# EAGLE design Baseboard Rev2 (EAGLE 9.6.2)

## Sheet 1 of 6
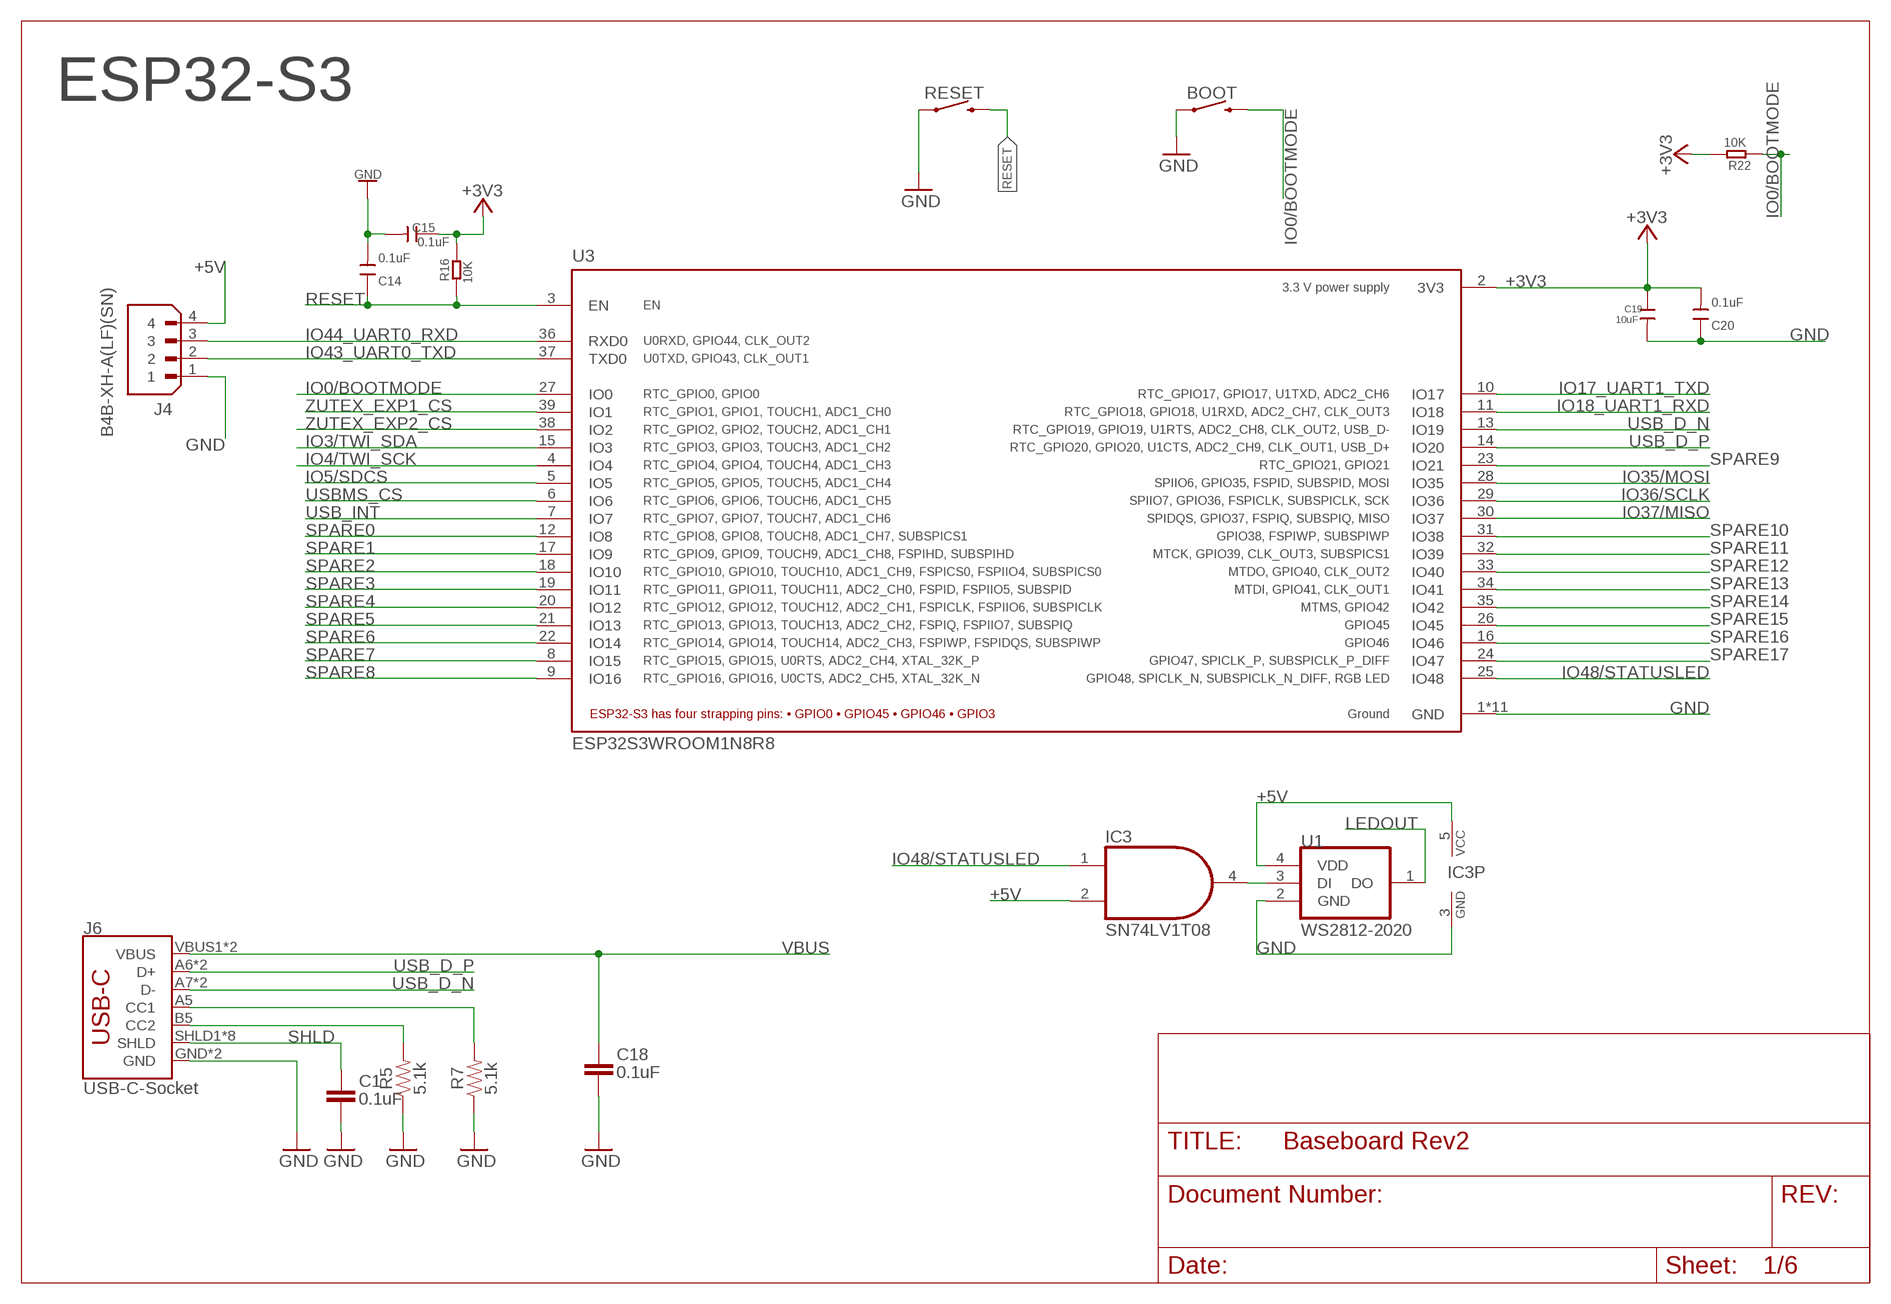
[diagram p0: schematic, sheet 1]

### Parts
BOOT  MOMENTARY-SWITCH-SPST-SMD-6.0X3.5MM  [TACTILE_SWITCH_SMD_6.0X3.5MM]
C1  0.1uF  CAP0603-CAP  [0603-CAP]
C14  0.1uF  DISCRETE_C-0603  [DISCRETE_C0603]
C15  0.1uF  DISCRETE_C-0603  [DISCRETE_C0603]
C18  0.1uF  CAP0603-CAP  [0603-CAP]
C19  10uF  C-1206  [C1206]
C20  0.1uF  DISCRETE_C-0603  [DISCRETE_C0603]
IC3  SN74LV1T08  74AHC1G08DBV  [SOT23-5]
J4  B4B-XH-A(LF)(SN)  [JST_B4B-XH-A(LF)(SN)]
J6  USB-C-Socket  USB_C16PIN  [USB-C-16P]
R5  5.1k  5.1KOHM5.1KOHM-0603-1/10W-1%  [0603@1]
R7  5.1k  5.1KOHM5.1KOHM-0603-1/10W-1%  [0603@1]
R16  10K  R-0603  [R0603]
R22  10K  R-0603  [R0603]
RESET  MOMENTARY-SWITCH-SPST-SMD-6.0X3.5MM  [TACTILE_SWITCH_SMD_6.0X3.5MM]
U1  WS2812-2020  [LED_WS2812-2020]
U3  ESP32S3WROOM1N8R8  [XCVR_ESP32S3WROOM1N8R8]

### Nets
+3V3: C15.1 C19.1 C20.2 R16.2 R22.2 U3.2(3V3) ; also sheet 2,3,4,5
+5V: IC3.2(I1) IC3.5(VCC) J4.4 U1.4(VDD) ; also sheet 2,4,5
CC1: J6.A5(CC1) R7.2
CC2: J6.B5(CC2) R5.2
GND: BOOT.1 C1.2 C14.2 C15.2 C18.2 C19.2 C20.1 IC3.3(GND) J4.1 J6.GND J6.GND2(GND) R5.1 R7.1 RESET.1 U1.2(GND) U3.1(GND) U3.40(GND) U3.41_1(GND) U3.41_2(GND) U3.41_3(GND) U3.41_4(GND) U3.41_5(GND) U3.41_6(GND) U3.41_7(GND) U3.41_8(GND) U3.41_9(GND) ; also sheet 2,3,4,5
IO0/BOOTMODE: BOOT.2 R22.1 U3.27(IO0)
IO3/TWI_SDA: U3.15(IO3) ; also sheet 5
IO4/TWI_SCK: U3.4(IO4) ; also sheet 5
IO5/SDCS: U3.5(IO5) ; also sheet 3
IO17_UART1_TXD: U3.10(IO17) ; also sheet 5
IO18_UART1_RXD: U3.11(IO18) ; also sheet 5
IO35/MOSI: U3.28(IO35) ; also sheet 3,4,5
IO36/SCLK: U3.29(IO36) ; also sheet 3,4,5
IO37/MISO: U3.30(IO37) ; also sheet 3,4,5
IO43_UART0_TXD: J4.2 U3.37(TXD0) ; also sheet 5
IO44_UART0_RXD: J4.3 U3.36(RXD0) ; also sheet 5
IO48/STATUSLED: IC3.1(I0) U3.25(IO48)
LEDOUT: U1.1(DO) ; also sheet 5
N$2: IC3.4(O) U1.3(DI)
RESET: C14.1 R16.1 RESET.2 U3.3(EN) ; also sheet 5
SHLD: C1.1 J6.SHLD1(SHLD) J6.SHLD2(SHLD) J6.SHLD3(SHLD) J6.SHLD4(SHLD) J6.SHLD5(SHLD) J6.SHLD6(SHLD) J6.SHLD7(SHLD) J6.SHLD8(SHLD)
SPARE0: U3.12(IO8) ; also sheet 5
SPARE1: U3.17(IO9) ; also sheet 5
SPARE2: U3.18(IO10) ; also sheet 5
SPARE3: U3.19(IO11) ; also sheet 5
SPARE4: U3.20(IO12) ; also sheet 5
SPARE5: U3.21(IO13) ; also sheet 5
SPARE6: U3.22(IO14) ; also sheet 5
SPARE7: U3.8(IO15) ; also sheet 5
SPARE8: U3.9(IO16) ; also sheet 5
SPARE9: U3.23(IO21) ; also sheet 5
SPARE10: U3.31(IO38) ; also sheet 5
SPARE11: U3.32(IO39) ; also sheet 5
SPARE12: U3.33(IO40) ; also sheet 5
SPARE13: U3.34(IO41) ; also sheet 5
SPARE14: U3.35(IO42) ; also sheet 5
SPARE15: U3.26(IO45) ; also sheet 5
SPARE16: U3.16(IO46) ; also sheet 5
SPARE17: U3.24(IO47) ; also sheet 5
USB_D_N: J6.A7(D-) J6.B7(D-) U3.13(IO19)
USB_D_P: J6.A6(D+) J6.B6(D+) U3.14(IO20)
USB_INT: U3.7(IO7) ; also sheet 4
USBMS_CS: U3.6(IO6) ; also sheet 4
VBUS: C18.1 J6.VBUS1(VBUS) J6.VBUS2(VBUS) ; also sheet 2
ZUTEX_EXP1_CS: U3.39(IO1) ; also sheet 5
ZUTEX_EXP2_CS: U3.38(IO2) ; also sheet 5

### Notes on the sheet
- ESP32-S3

## Sheet 2 of 6
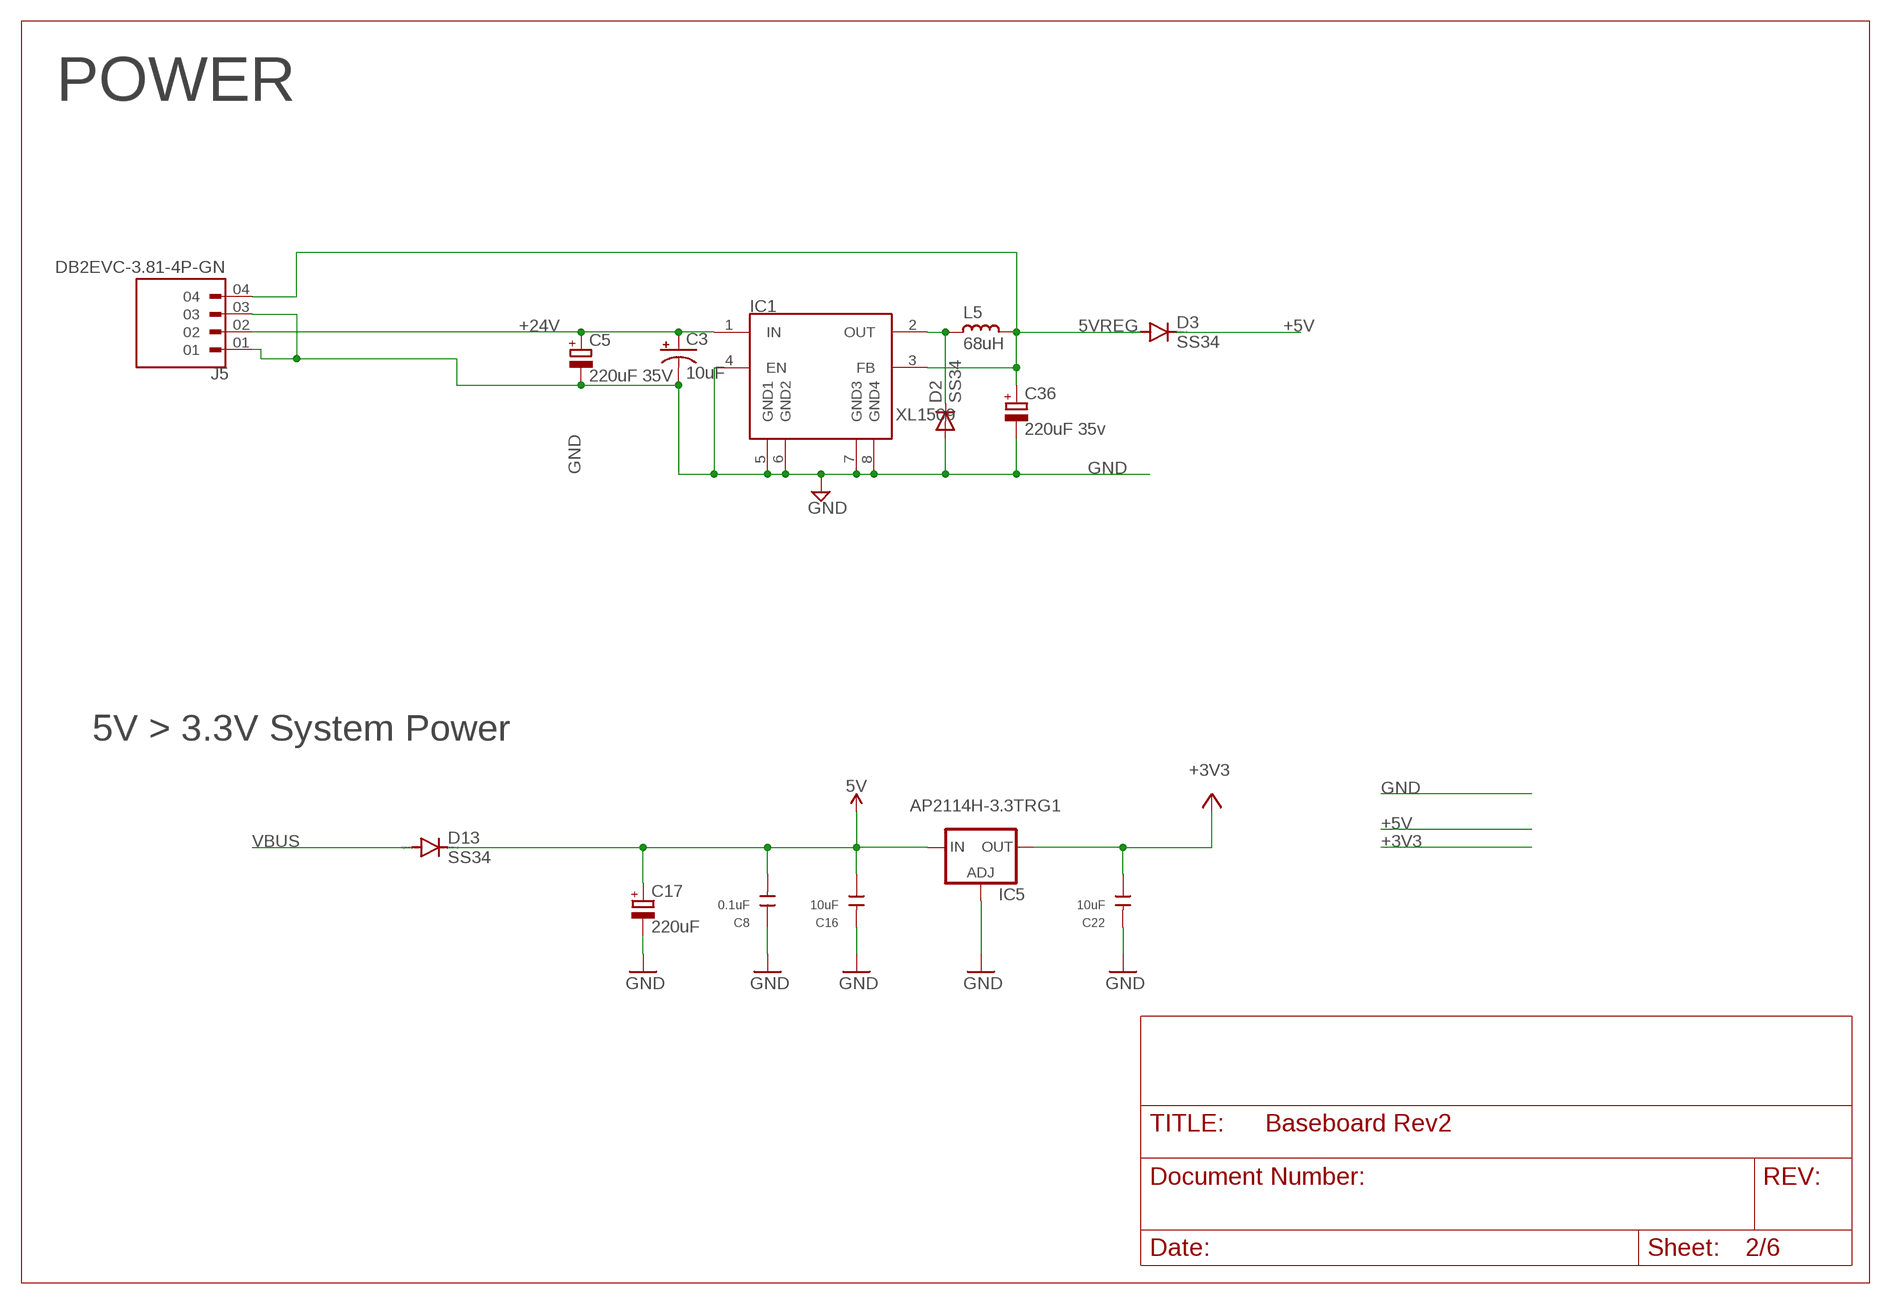
[diagram p1: schematic, sheet 2]

### Parts
C3  10uF  CAP_POL1206  [EIA3216]
C5  220uF 35V  CPOL-EUD  [PANASONIC_D]
C8  0.1uF  DISCRETE_C-0603  [DISCRETE_C0603]
C16  10uF  C-1206  [C1206]
C17  220uF  CPOL-EUD  [PANASONIC_D]
C22  10uF  C-1206  [C1206]
C36  220uF 35v  CPOL-EUD  [PANASONIC_D]
D2  SS34  DIODE-DO-214AC  [DO-214AC]
D3  SS34  DIODE-DO-214AC  [DO-214AC]
D13  SS34  DIODE-DO-214AC  [DO-214AC]
IC1  XL1509  [SO08]
IC5  AP2114H-3.3TRG1  LD117AS33TR  [SOT223]
J5  DB2EVC-3.81-4P-GN  [DB2EVC-3.81-4P-GN]
L5  68uH  L_CD75  [CD75]

### Nets
5VREG: C36.+ D3.A IC1.3(FB) J5.04 L5.1
+3V3: C22.1 IC5.4(OUT) ; also sheet 1,3,4,5
+5V: C8.2 C16.1 C17.+ D3.C D13.C IC5.3(IN) ; supply symbol labelled 5V ; also sheet 1,4,5
+24V: C3.A(+) C5.+ IC1.1(IN) J5.02 ; also sheet 5
GND: C3.C(-) C5.- C8.1 C16.2 C17.- C22.2 C36.- D2.2(A) IC1.4(EN) IC1.5(GND1) IC1.6(GND2) IC1.7(GND3) IC1.8(GND4) IC5.1(ADJ) J5.01 J5.03 ; also sheet 1,3,4,5
N$37: D2.1(C) IC1.2(OUT) L5.2
VBUS: D13.A ; also sheet 1

### Notes on the sheet
- POWER
- 5V > 3.3V System Power

## Sheet 3 of 6
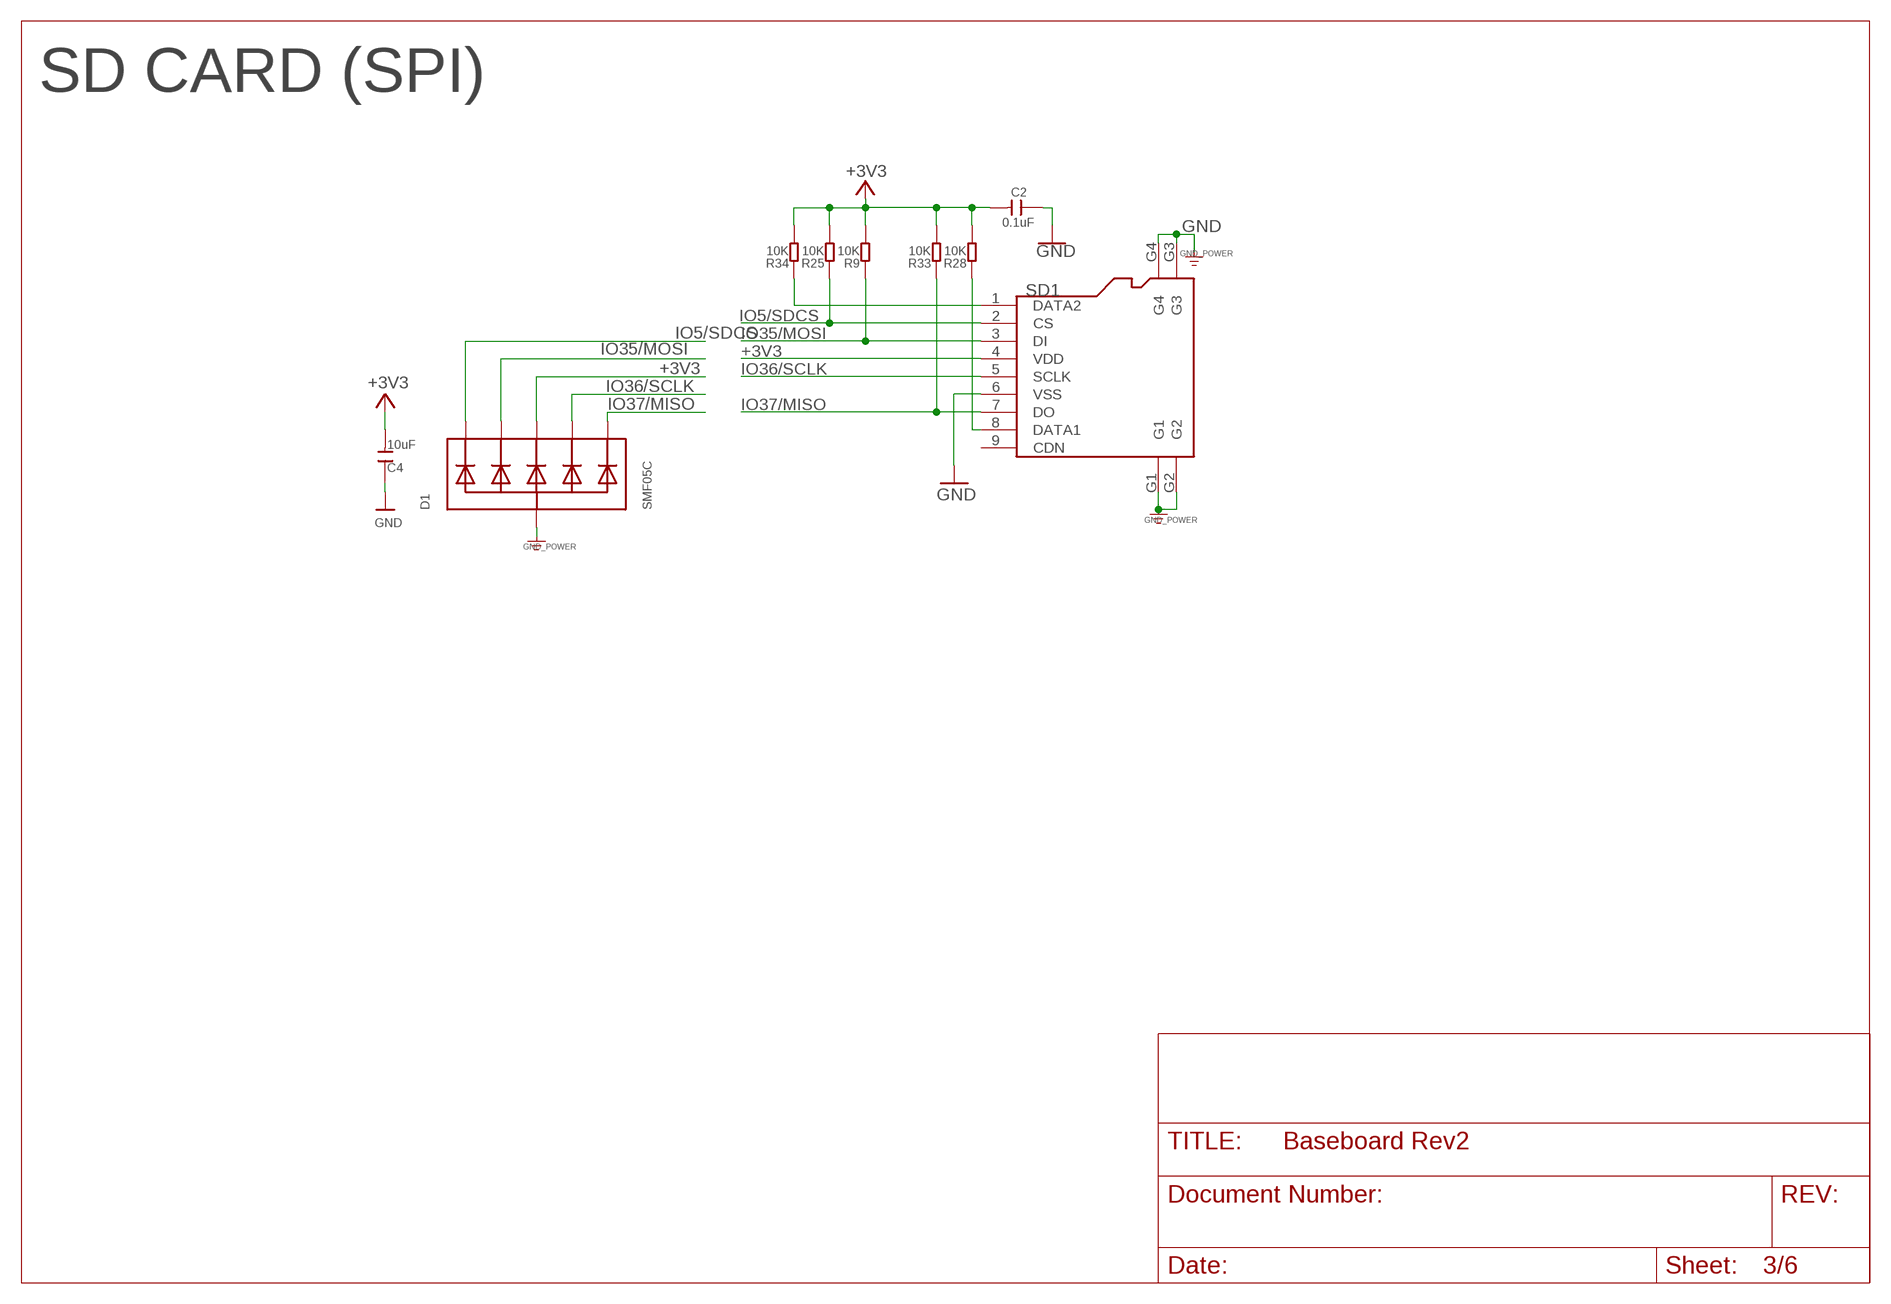
[diagram p2: schematic, sheet 3]

### Parts
C2  0.1uF  DISCRETE_C-0603  [DISCRETE_C0603]
C4  10uF  DISCRETE_C-1206  [DISCRETE_C1206]
D1  SMF05C  TVSARRAY_5LANE  [SOT363]
R9  10K  DISCRETE_R-0603  [DISCRETE_R0603]
R25  10K  DISCRETE_R-0603  [DISCRETE_R0603]
R28  10K  DISCRETE_R-0603  [DISCRETE_R0603]
R33  10K  DISCRETE_R-0603  [DISCRETE_R0603]
R34  10K  DISCRETE_R-0603  [DISCRETE_R0603]
SD1  HOLDER-MICROSD-9P  [9P-SMD-W/-RING]

### Nets
+3V3: C2.2 C4.2 D1.4(C3) R9.2 R25.2 R28.2 R33.2 R34.2 SD1.4(VDD) ; also sheet 1,2,4,5
GND: C2.1 C4.1 D1.2(A) SD1.6(VSS) SD1.G1 SD1.G2 SD1.G3 SD1.G4 ; supply symbol labelled GND_POWER ; also sheet 1,2,4,5
IO5/SDCS: D1.1(C1) R25.1 SD1.2(CS) ; also sheet 1
IO35/MOSI: D1.3(C2) R9.1 SD1.3(DI) ; also sheet 1,4,5
IO36/SCLK: D1.5(C4) SD1.5(SCLK) ; also sheet 1,4,5
IO37/MISO: D1.6(C5) R33.1 SD1.7(DO) ; also sheet 1,4,5
N$47: R34.1 SD1.1(DATA2)
N$48: R28.1 SD1.8(DATA1)
Unconnected: SD1.9(CDN)

### Notes on the sheet
- SD CARD (SPI)

## Sheet 4 of 6
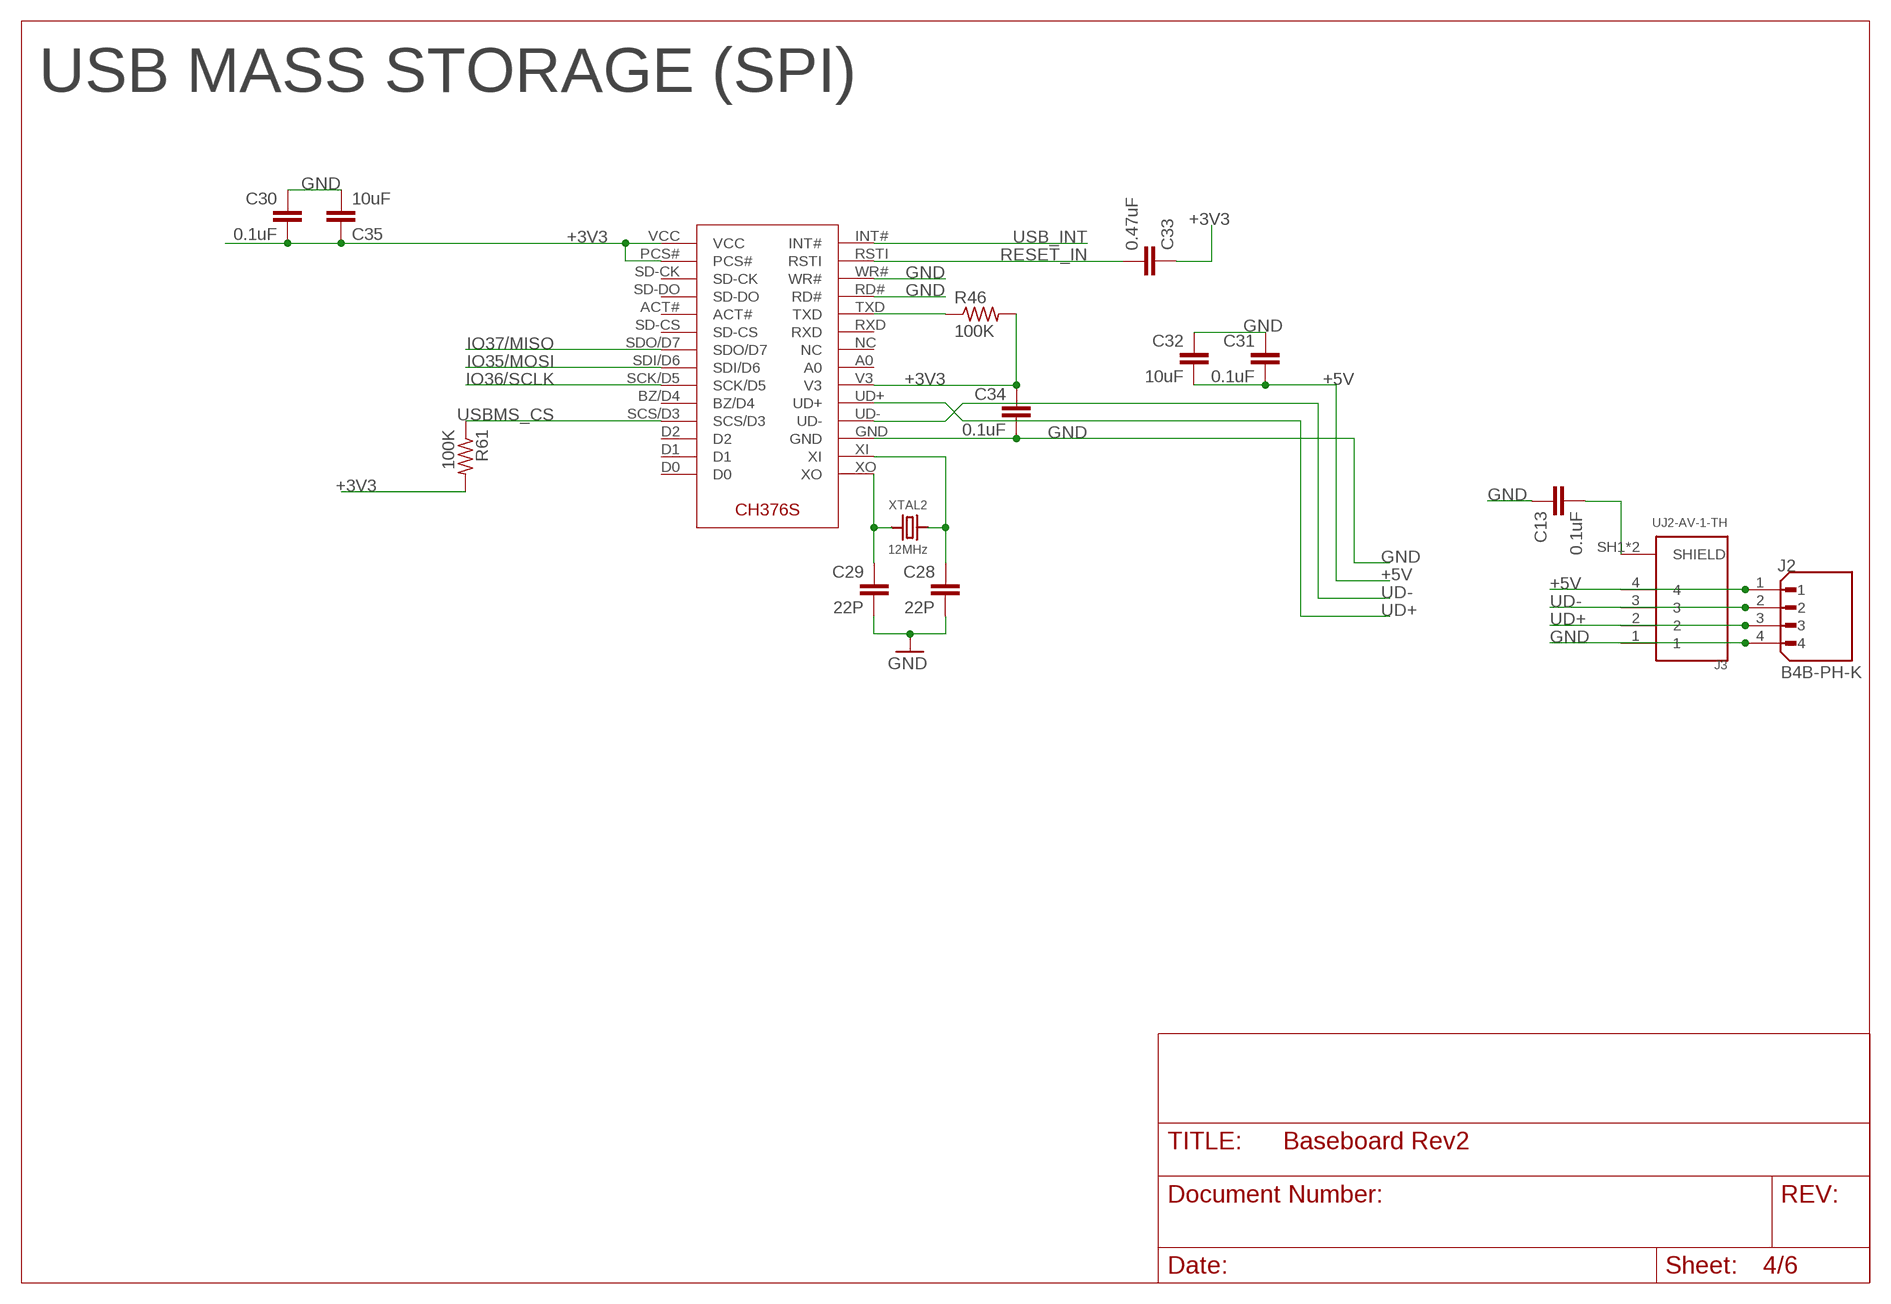
[diagram p3: schematic, sheet 4]

### Parts
C13  0.1uF  C-EUC0603  [C0603]
C28  22P  C-EUC0603  [C0603]
C29  22P  C-EUC0603  [C0603]
C30  0.1uF  C-EUC0603  [C0603]
C31  0.1uF  C-EUC0603  [C0603]
C32  10uF  C-EUC1206  [C1206]
C33  0.47uF  C-EUC0603  [C0603]
C34  0.1uF  C-EUC0603  [C0603]
C35  10uF  C-EUC1206  [C1206]
IC2  CH376  [CH376S-SOIC]
J2  B4B-PH-K  [JST_B4B-PH-K]
J3  UJ2-AV-1-TH  [CUI_UJ2-AV-1-TH]
R46  100K  R-US_R0603  [R0603]
R61  100K  R-US_R0603  [R0603]
XTAL2  12MHz  CRYSTALTHIN  [CRYSTAL_3.2X2.5]

### Nets
+3V3: C30.2 C33.1 C34.1 C35.1 IC2.PCS# IC2.V3 IC2.VCC R46.2 R61.2 ; also sheet 1,2,3,5
+5V: C31.2 C32.2 J2.1 J3.4 ; also sheet 1,2,5
GND: C13.1 C28.2 C29.2 C30.1 C31.1 C32.1 C34.2 C35.2 IC2.GND IC2.RD# IC2.WR# J2.4 J3.1 ; also sheet 1,2,3,5
IO35/MOSI: IC2.SDI/D6 ; also sheet 1,3,5
IO36/SCLK: IC2.SCK/D5 ; also sheet 1,3,5
IO37/MISO: IC2.SDO/D7 ; also sheet 1,3,5
N$19: C13.2 J3.SH1(SHIELD) J3.SH2(SHIELD)
N$31: C28.1 IC2.XI XTAL2.1
N$32: C29.1 IC2.XO XTAL2.2
N$38: IC2.TXD R46.1
RESET_IN: C33.2 IC2.RSTI
UD+: IC2.UD+ J2.3 J3.2
UD-: IC2.UD- J2.2 J3.3
USB_INT: IC2.INT# ; also sheet 1
USBMS_CS: IC2.SCS/D3 R61.1 ; also sheet 1
Unconnected: IC2.A0 IC2.ACT# IC2.BZ/D4 IC2.D0 IC2.D1 IC2.D2 IC2.NC IC2.RXD IC2.SD-CK IC2.SD-CS IC2.SD-DO

### Notes on the sheet
- USB MASS STORAGE (SPI)

## Sheet 5 of 6
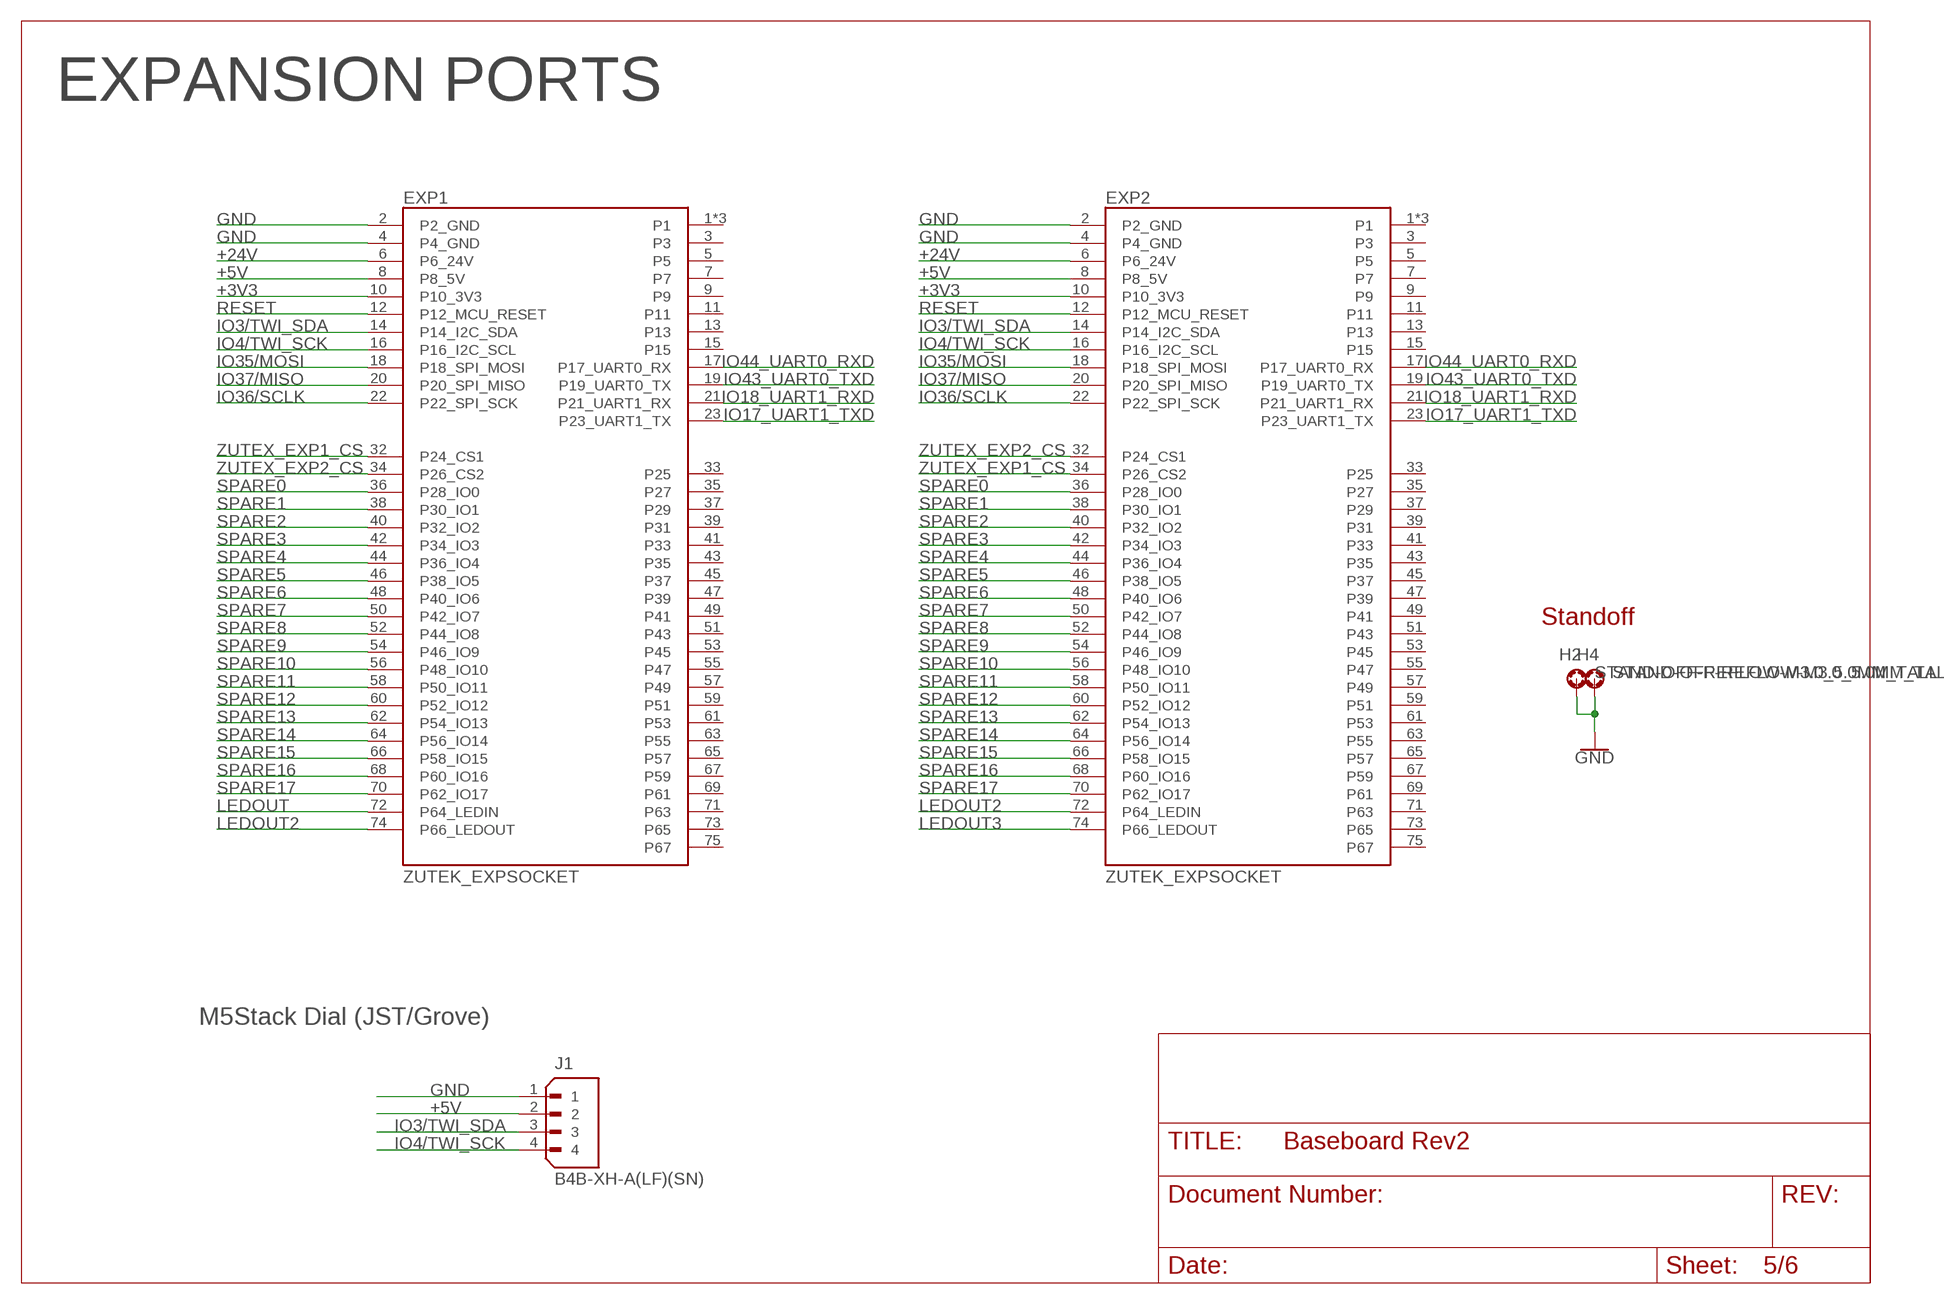
[diagram p4: schematic, sheet 5]

### Parts
EXP1  ZUTEK_EXPSOCKET  [M.2-CONNECTOR-E-ZUTEK]
EXP2  ZUTEK_EXPSOCKET  [M.2-CONNECTOR-E-ZUTEK]
H2  STAND-OFF-REFLOW-M3.0_5.0MM_TALL  [STAND-OFF-REFLOW-M3.0]
H4  STAND-OFF-REFLOW-M3.0_5.0MM_TALL  [STAND-OFF-REFLOW-M3.0]
J1  B4B-XH-A(LF)(SN)  [JST_B4B-XH-A(LF)(SN)]

### Nets
+3V3: EXP1.10(P10_3V3) EXP2.10(P10_3V3) ; also sheet 1,2,3,4
+5V: EXP1.8(P8_5V) EXP2.8(P8_5V) J1.2 ; also sheet 1,2,4
+24V: EXP1.6(P6_24V) EXP2.6(P6_24V) ; also sheet 2
GND: EXP1.2(P2_GND) EXP1.4(P4_GND) EXP2.2(P2_GND) EXP2.4(P4_GND) H2.1 H4.1 J1.1 ; also sheet 1,2,3,4
IO3/TWI_SDA: EXP1.14(P14_I2C_SDA) EXP2.14(P14_I2C_SDA) J1.3 ; also sheet 1
IO4/TWI_SCK: EXP1.16(P16_I2C_SCL) EXP2.16(P16_I2C_SCL) J1.4 ; also sheet 1
IO17_UART1_TXD: EXP1.23(P23_UART1_TX) EXP2.23(P23_UART1_TX) ; also sheet 1
IO18_UART1_RXD: EXP1.21(P21_UART1_RX) EXP2.21(P21_UART1_RX) ; also sheet 1
IO35/MOSI: EXP1.18(P18_SPI_MOSI) EXP2.18(P18_SPI_MOSI) ; also sheet 1,3,4
IO36/SCLK: EXP1.22(P22_SPI_SCK) EXP2.22(P22_SPI_SCK) ; also sheet 1,3,4
IO37/MISO: EXP1.20(P20_SPI_MISO) EXP2.20(P20_SPI_MISO) ; also sheet 1,3,4
IO43_UART0_TXD: EXP1.19(P19_UART0_TX) EXP2.19(P19_UART0_TX) ; also sheet 1
IO44_UART0_RXD: EXP1.17(P17_UART0_RX) EXP2.17(P17_UART0_RX) ; also sheet 1
LEDOUT: EXP1.72(P64_LEDIN) ; also sheet 1
LEDOUT2: EXP1.74(P66_LEDOUT) EXP2.72(P64_LEDIN)
LEDOUT3: EXP2.74(P66_LEDOUT)
RESET: EXP1.12(P12_MCU_RESET) EXP2.12(P12_MCU_RESET) ; also sheet 1
SPARE0: EXP1.36(P28_IO0) EXP2.36(P28_IO0) ; also sheet 1
SPARE1: EXP1.38(P30_IO1) EXP2.38(P30_IO1) ; also sheet 1
SPARE2: EXP1.40(P32_IO2) EXP2.40(P32_IO2) ; also sheet 1
SPARE3: EXP1.42(P34_IO3) EXP2.42(P34_IO3) ; also sheet 1
SPARE4: EXP1.44(P36_IO4) EXP2.44(P36_IO4) ; also sheet 1
SPARE5: EXP1.46(P38_IO5) EXP2.46(P38_IO5) ; also sheet 1
SPARE6: EXP1.48(P40_IO6) EXP2.48(P40_IO6) ; also sheet 1
SPARE7: EXP1.50(P42_IO7) EXP2.50(P42_IO7) ; also sheet 1
SPARE8: EXP1.52(P44_IO8) EXP2.52(P44_IO8) ; also sheet 1
SPARE9: EXP1.54(P46_IO9) EXP2.54(P46_IO9) ; also sheet 1
SPARE10: EXP1.56(P48_IO10) EXP2.56(P48_IO10) ; also sheet 1
SPARE11: EXP1.58(P50_IO11) EXP2.58(P50_IO11) ; also sheet 1
SPARE12: EXP1.60(P52_IO12) EXP2.60(P52_IO12) ; also sheet 1
SPARE13: EXP1.62(P54_IO13) EXP2.62(P54_IO13) ; also sheet 1
SPARE14: EXP1.64(P56_IO14) EXP2.64(P56_IO14) ; also sheet 1
SPARE15: EXP1.66(P58_IO15) EXP2.66(P58_IO15) ; also sheet 1
SPARE16: EXP1.68(P60_IO16) EXP2.68(P60_IO16) ; also sheet 1
SPARE17: EXP1.70(P62_IO17) EXP2.70(P62_IO17) ; also sheet 1
ZUTEX_EXP1_CS: EXP1.32(P24_CS1) EXP2.34(P26_CS2) ; also sheet 1
ZUTEX_EXP2_CS: EXP1.34(P26_CS2) EXP2.32(P24_CS1) ; also sheet 1
Unconnected: EXP1.1 EXP1.3 EXP1.5 EXP1.7 EXP1.9 EXP1.11 EXP1.13 EXP1.15 EXP1.33(P25) EXP1.35(P27) EXP1.37(P29) EXP1.39(P31) EXP1.41(P33) EXP1.43(P35) EXP1.45(P37) EXP1.47(P39) EXP1.49(P41) EXP1.51(P43) EXP1.53(P45) EXP1.55(P47) EXP1.57(P49) EXP1.59(P51) EXP1.61(P53) EXP1.63(P55) EXP1.65(P57) EXP1.67(P59) EXP1.69(P61) EXP1.71(P63) EXP1.73(P65) EXP1.75(P67) EXP1.A1(P1) EXP1.A2(P1) EXP2.1 EXP2.3 EXP2.5 EXP2.7 EXP2.9 EXP2.11 EXP2.13 EXP2.15 EXP2.33(P25) EXP2.35(P27) EXP2.37(P29) EXP2.39(P31) EXP2.41(P33) EXP2.43(P35) EXP2.45(P37) EXP2.47(P39) EXP2.49(P41) EXP2.51(P43) EXP2.53(P45) EXP2.55(P47) EXP2.57(P49) EXP2.59(P51) EXP2.61(P53) EXP2.63(P55) EXP2.65(P57) EXP2.67(P59) EXP2.69(P61) EXP2.71(P63) EXP2.73(P65) EXP2.75(P67) EXP2.A1(P1) EXP2.A2(P1)

### Notes on the sheet
- EXPANSION PORTS
- Standoff
- M5Stack Dial (JST/Grove)

## Sheet 6 of 6

## Library data of the parts
BOOT RESET = SparkFun-Switches:MOMENTARY-SWITCH-SPST: Momentary Switch (Pushbutton) - SPST Normally-open (NO) SPST momentary switches (buttons, pushbuttons). Variants PTH-12MM - 12mm square, through-hole Momentary Pushbutton Switch - 12mm Square <https://www.sparkfun.com/products/9190> (COM-09190) PTH-6.0MM, PTH-6.0MM-KIT - 6.0mm square, through-hole Mini Pushbutton Switch <https://www.sparkfun.com/products/97> (COM-00097) KIT package intended for soldering kit's - only one side of pads' copper is exposed. PTH-RIGHT-ANGLE-KIT - Right-angle, through-hole Right Angle Tactile Button <https://www.sparkfun.com/products/10791> - Used on SparkFun BigTime Watch Kit <https://www.sparkfun.com/products/11734> SMD-12MM - 12mm square, surface-mount Tactile Button - SMD (12mm) <https://www.sparkfun.com/products/12993> (COM-12993) Used on SparkFun PicoBoard <https://www.sparkfun.com/products/11888> SMD-4.5MM - 4.5mm Square Trackball Switch Used on SparkFun Blackberry Trackballer Breakout <https://www.sparkfun.com/products/13169> SMD-4.6MMX2.8MM - 4.60mm x 2.80mm, surface mount Used on SparkFun Pro Micro - RP2040 <https://www.sparkfun.com/products/17717> SMD-5.2MM, SMD-5.2-REDUNDANT - 5.2mm square, surface-mount Mini Pushbutton Switch - SMD <https://www.sparkfun.com/products/8720> (COM-08720) Used on Arduino Pro Mini <https://www.sparkfun.com/products/11114> REDUNDANT package connects both switch circuits together SMD-6.0X3.5MM - 6.0 x 3.5mm, surface mount Momentary Reset Switch SMD <https://www.sparkfun.com/products/8229> (COM-08229) SMD-6.2MM-TALL - 6.2mm square, surface mount Tactile Button - SMD (6mm) <https://www.sparkfun.com/products/12992> Used on SparkFun Digital Sandbox <https://www.sparkfun.com/products/12651> SMD-RIGHT-ANGLE - Right-angle, surface mount Used on SparkFun Block for Intel® Edison - Arduino <https://www.sparkfun.com/products/13036>; PROD_ID: SWCH-14278; SF_SKU: COM-08229
C1 C18 = SparkFun:CAP: Capacitor Standard 0603 ceramic capacitor, and 0.1" leaded capacitor.
C2 C4 C8 C14 C15 C20 = A9G:DISCRETE_C*: Ceramic Capacitors
C3 = SparkFun:CAP_POL: Capacitor Polarized These are standard SMD and PTH capacitors. Normally 10uF, 47uF, and 100uF in electrolytic and tantalum varieties. Always verify the external diameter of the through hole cap, it varies with capacity, voltage, and manufacturer. The EIA devices should be standard.
C5 C36 = rcl:CPOL-EU: POLARIZED CAPACITOR, European symbol
C13 C28-C35 = rcl:C-EU: CAPACITOR, European symbol
C16 C19 C22 = discrete:C*: Ceramic Capacitors
C17 = rcl:CPOL-EU: POLARIZED CAPACITOR, European symbol; SPICEPREFIX: C
D1 = microbuilder:TVSARRAY_5LANE: Voltage Transient Suppressor Array SOT363 SMF05C - 100W 5V: Digikey - SMF05CT1GOSCT-ND
D2 = dp_devices:DIODE: Various Diode Packages
D3 D13 = diode:DIODE-: DIODE
EXP1 EXP2 = zutek_m.2:ZUTEK_EXP: MicroMod Connector Description: A card edge connector and mating PCB connector to allow various MicroMod Processor Boards to be coupled with various carrier boards of different capabilities. Based on the M.2 standard.; PROD_ID: CONN-14877
H2 H4 = SparkFun-Hardware:STAND-OFF-REFLOW: Stand Off Reflow Compatible A metal standoff that can be placed and reflowed onto a PCB. The M2.5 x 2.5mm variant is used on MicroMod. The M2.5 x 1.5mm variant is used to hold mPCIe boards, including the Swarm M138. The M2.0 x 6.0mm variant is used to mount the Iridium 9603N modem.; PROD_ID: HW-16213
IC1 = Cohesion_parts:XL1509
IC2 = CH376S:CH376
IC3 = 74xx-little-us:74*1G08: 2-input AND gate
IC5 = v-reg:LD117A?*: Low drop fixed and adjustable positive voltage regulators 1 A Source: http://www.st.com/stonline/products/literature/ds/7194/ld1117axx.pdf
J1 J4 = B4B-XH-A_LF__SN_:B4B-XH-A(LF)(SN): Check availability <https://pricing.snapeda.com/parts/B4B-XH-A%20%28LF%29%28SN%29/JST%20Sales/view-part?ref=eda>; AVAILABILITY: In Stock; CHECK_PRICES: https://www.snapeda.com/parts/B4B-XH-A%20(LF)(SN)/JST/view-part/?ref=eda; DESCRIPTION: Connector Header Through Hole 4 position 0.098 (2.50mm); MF: JST Sales; MP: B4B-XH-A (LF)(SN); PACKAGE: None; PRICE: None; SNAPEDA_LINK: https://www.snapeda.com/parts/B4B-XH-A%20(LF)(SN)/JST/view-part/?ref=snap
J2 = B4B-PH-K:B4B-PH-K: Check availability <https://pricing.snapeda.com/parts/B4B-PH-K/JST/view-part?ref=eda>; AVAILABILITY: In Stock; CHECK_PRICES: https://www.snapeda.com/parts/B4B-PH-K/JST/view-part/?ref=eda; DESCRIPTION: 2.0 mm pitch/Disconnectable Crimp style connectors; MF: JST; MP: B4B-PH-K; PACKAGE: None; PRICE: None; SNAPEDA_LINK: https://www.snapeda.com/parts/B4B-PH-K/JST/view-part/?ref=snap
J3 = UJ2-AV-1-TH (1):UJ2-AV-1-TH: Check availability <https://pricing.snapeda.com/parts/UJ2-AV-1-TH/Same%20Sky/view-part?ref=eda>; AVAILABILITY: In Stock; CHECK_PRICES: https://www.snapeda.com/parts/UJ2-AV-1-TH/Same+Sky/view-part/?ref=eda; DESCRIPTION: Type A, USB 2.0, 480 Mbps, 30 Vac, 1 A, Vertical, Through Hole, 3 µin plating thickness, Black Insulator, USB Receptacle; MF: Same Sky; MP: UJ2-AV-1-TH; PACKAGE: None; PRICE: None; SNAPEDA_LINK: https://www.snapeda.com/parts/UJ2-AV-1-TH/Same+Sky/view-part/?ref=snap
J5 = DB2EVC-3.81-4P-GN:DB2EVC-3.81-4P-GN: Check availability <https://pricing.snapeda.com/parts/1803439/Phoenix%20Contact/view-part?ref=eda>; AVAILABILITY: In Stock; CHECK_PRICES: https://www.snapeda.com/parts/1803439/Phoenix+Contact/view-part/?ref=eda; DESCRIPTION: Pluggable Header 3.81mm 16AWG 160V 8A 3 Position COMBICON MCV Series | Phoenix Contact 1803439; MF: Phoenix Contact; MP: 1803439; PACKAGE: None; PRICE: None; SNAPEDA_LINK: https://www.snapeda.com/parts/1803439/Phoenix+Contact/view-part/?ref=snap
J6 = SparkFun-Connectors:USB_C: USB Type C 16Pin Connector Super Speed pins not available on the 16-pin purely SMD connector so this part is best for USB 2.0 implementations. D1 and D2 are tied together enabling D+/- no matter which way the cable is plugged into the connector. The two channel configuration pins (CC1/2) are exposed. These are normally connected to ground via 5.1k resistors but can be reconfigured for high current/high power applications.; PROD_ID: CONN-14122
L5 = rc-master-smd:L_: INDUCTOR
R5 R7 = SparkFun-Resistors:5.1KOHM; PROD_ID: RES-12083
R9 R25 R28 R33 R34 = A9G:DISCRETE_R*
R16 R22 = discrete:R*
R46 R61 = adafruit:R-US_: RESISTOR, American symbol
SD1 = Connector:HOLDER-MICROSD-9P
U1 = WS2812-2020:WS2812-2020: Check availability <https://pricing.snapeda.com/parts/WS2812-2020/Worldsemi/view-part?ref=eda>; AVAILABILITY: Not in stock; CHECK_PRICES: https://www.snapeda.com/parts/WS2812-2020/Worldsemi/view-part/?ref=eda; DESCRIPTION: Intelligent control LED light source, SMD-4; MF: Worldsemi; MP: WS2812-2020; PACKAGE: Package; PRICE: None; SNAPEDA_LINK: https://www.snapeda.com/parts/WS2812-2020/Worldsemi/view-part/?ref=snap
U3 = ESP32S3WROOM1N8R8:ESP32S3WROOM1N8R8: Check availability <https://pricing.snapeda.com/parts/ESP32S3WROOM1N8R8/Espressif%20Systems/view-part?ref=eda>; AVAILABILITY: In Stock; DESCRIPTION: Bluetooth, WiFi 802.11b/g/n, Bluetooth v5.0 Transceiver Module 2.4GHz PCB Trace Surface Mount; MF: Espressif Systems; MP: ESP32S3WROOM1N8R8; PACKAGE: None; PRICE: None; PURCHASE-URL: https://pricing.snapeda.com/search/part/ESP32S3WROOM1N8R8/?ref=eda
XTAL2 = microbuilder:CRYSTAL: Crystals HC49UP - Surface Mount Crystal 4.0MHz 18pF +/-30ppm Surface Mount Crystal [Digikey: 535-9857-1-ND] 12.0 MHz Surface Mount Crystal [Digikey: 535-9869-6-ND] 25.0 MHz Surface Mount Crystal [Digikey: 535-9078-1-ND] 3.2 x 2.5mm - MEMs SMT Crystal 12.0 MHz 8pF 15ppm 3.2 x 2.5mm Crystal [Digikey: -10-70°C: 644-1047-1-ND -40-125°C: 644-1128-1-ND] 16.0 MHz 8pF 15ppm 3.2 x 2.5mm Crystal [Digikey: -10-70°C: 644-1049-1-ND -40-125°C: 644-1129-2-ND] 16.0 MHz 10pF 10ppm 3.2 x 2.5mm Crystal [Digikey: 644-1100-1-ND] 27.12 MHz 18pF 30ppm 3.2 x 2.5mm Crystal [Digikey: 887-1424-1-ND] 27.12MHz 10pF 10ppm 3.2 x 2.5mm Crystal [Digikey: 887-1329-1-ND] 4.9 x 1.8mm - MEMs SMT Crystal 32.768 KHz 12.5pF 20ppm 4.9 x 1.8mm Crystal [Digikey: SE2415CT-ND] Cylinder 32.768KHz Cylinder Crystal

## Net classes
0 default: width 0.178 mm, drill 0.305 mm

## Board
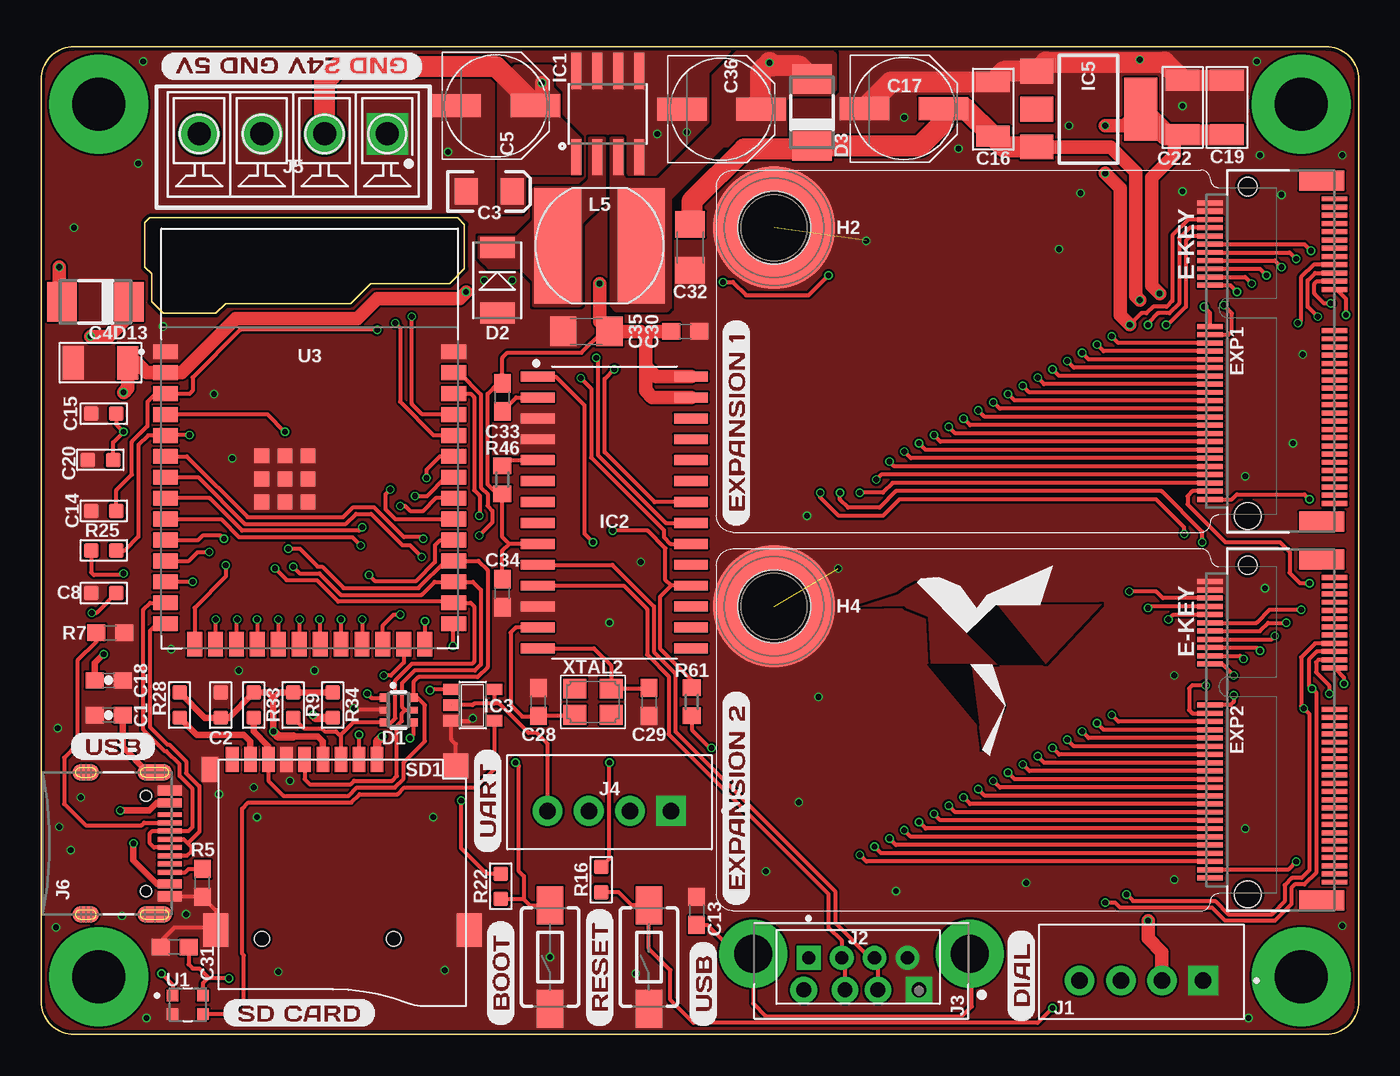
[diagram p5: board, top side]
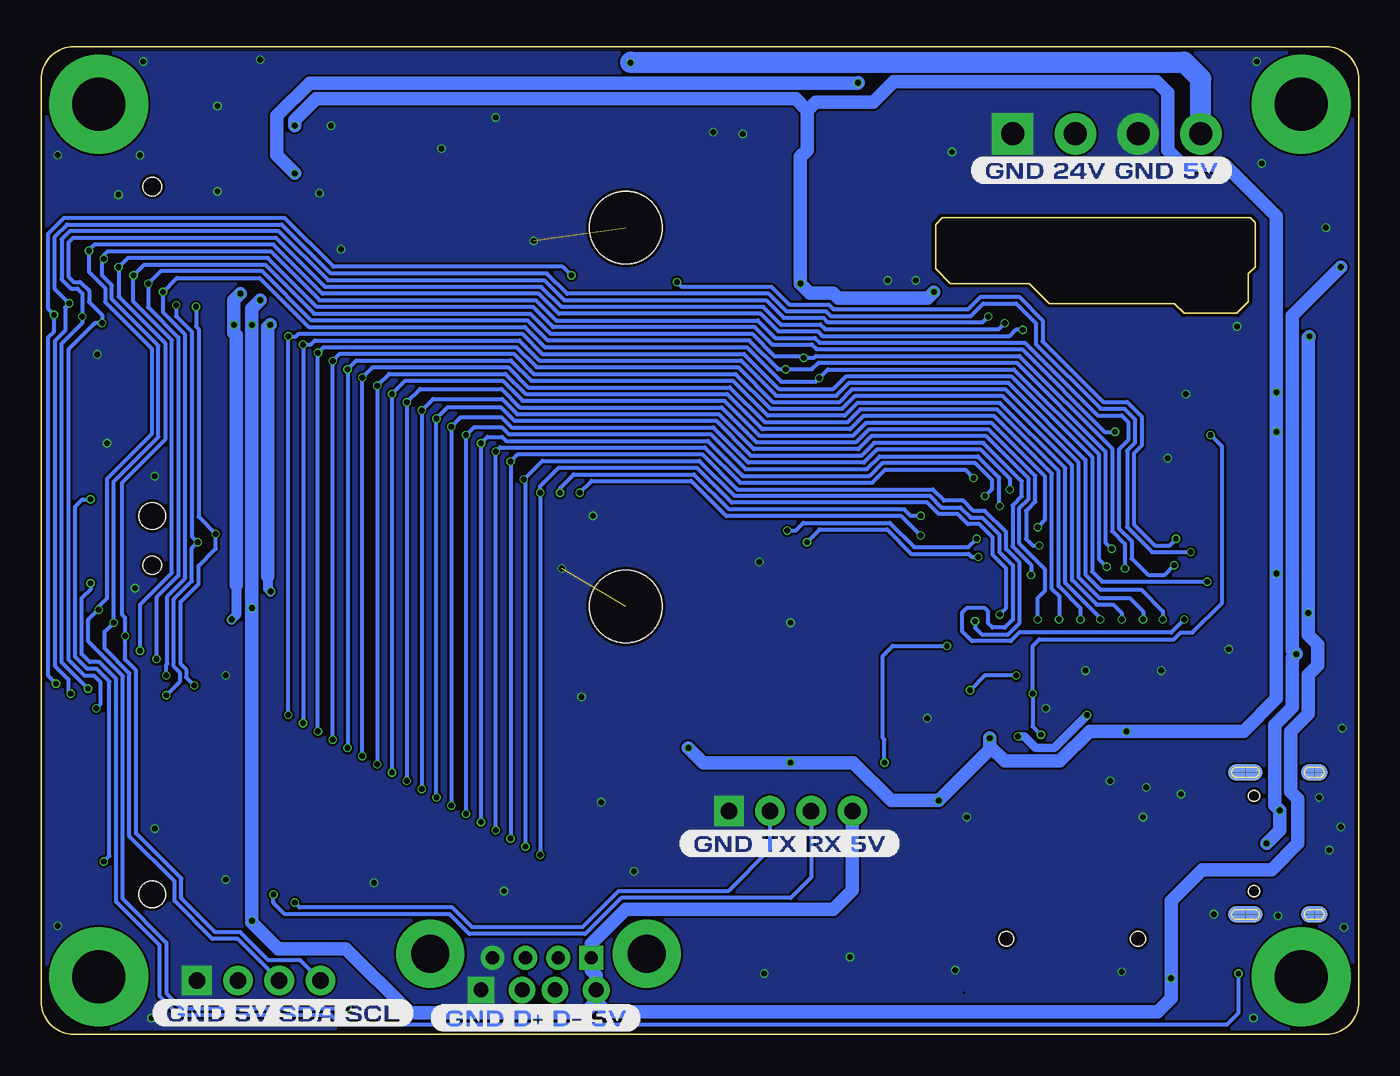
[diagram p6: board, bottom side, seen from below]

Size 80 x 60 mm. Coordinates in mm from the lower left corner, seen from the top.
Outline: 80,2 80,58 arc90 78,60 2,60 arc90 0,58 0,2 arc90 2,0 78,0 arc90 80,2
Outline: 7.4,43.8 10.6,43.8 11.2,44.4 18.8,44.4 20,45.6 24.8,45.6 25.7,46.5 25.7,49.2 25.3,49.6 6.6,49.6 6.3,49.3 6.3,46.6 6.7,46.2 6.7,44.5 7.4,43.8
Copper layers (1*16): Top 0.035mm / dielectric 1.6mm / Bottom 0.035mm
Design rules "jlcpcb-2layers": minimum track width 5mil, minimum drill 0.3mm, track to track 5mil, track to pad 5mil, pad to pad 5mil, via to via 5mil, smd to smd 5mil, copper to edge 0.2mm, drill to drill 6mil, minimum pad ring 10mil, minimum via ring 3mil, stop-mask expansion 4mil, vias tented up to drill 0mil, thermal gap 10mil
tRestrict: area 56.2,22.5 to 60.9,26.1; area 53.8,18.8 to 56.9,22.5; area 53.2,24.4 to 61.4,28.5; area 56.4,20 to 58.5,22.5; area 57.1,16.9 to 58.5,20
bRestrict: area 23.9,2.5 to 24.1,2.6

### Footprints (pad centres in the part's own frame; a part is rotated, then mirrored left to right if it is on the bottom)
TACTILE_SWITCH_SMD_6.0X3.5MM = smd 2.3 x 1.6: 1 -3.15,0; 2 3.15,0
0603-CAP = smd 1.1 x 1: 1 -0.85,0; 2 0.85,0
DISCRETE_C0603 = smd 0.889 x 0.889: 1 -0.762,0; 2 0.762,0
EIA3216 = smd 1.4 x 1.6: A 1.4,0; C -1.4,0
DISCRETE_C1206 = smd 1.27 x 2.032: 1 -1.651,0; 2 1.651,0
PANASONIC_D = smd 3 x 1.4: + 2.4,0; - -2.4,0
C0603 = smd 1.1 x 1: 1 -0.85,0; 2 0.85,0
C1206 = smd 1.27 x 2.032: 1 -1.651,0; 2 1.651,0
C1206' = smd 1.6 x 1.8: 1 -1.4,0; 2 1.4,0
SOT363 = smd 0.5 x 0.5: 1 -0.75,-0.9; 3 0.75,-0.9; 4 0.75,0.9; 6 -0.75,0.9 | smd 0.4 x 0.5: 2 0,-0.9; 5 0,0.9
DO-214AC = smd 1.27 x 2.1: 1 -1.98,0; 2 1.98,0
DO-214AC' = smd 1.8 x 2.4: A 2.025,0; C -2.025,0
M.2-CONNECTOR-E-ZUTEK = smd 0.3 x 1.55: 1 9.25,-3.525; 2 9,4.025; 3 8.75,-3.525; 4 8.5,4.025; 5 8.25,-3.525; 6 8,4.025; 7 7.75,-3.525; 8 7.5,4.025; 9 7.25,-3.525; 10 7,4.025; 11 6.75,-3.525; 12 6.5,4.025; 13 6.25,-3.525; 14 6,4.025; 15 5.75,-3.525; 16 5.5,4.025; 17 5.25,-3.525; 18 5,4.025; 19 4.75,-3.525; 20 4.5,4.025; 21 4.25,-3.525; 22 4,4.025; 23 3.75,-3.525; 32 1.5,4.025; 33 1.25,-3.525; 34 1,4.025; 35 0.75,-3.525; 36 0.5,4.025; 37 0.25,-3.525; 38 0,4.025; 39 -0.25,-3.525; 40 -0.5,4.025; 41 -0.75,-3.525; 42 -1,4.025; 43 -1.25,-3.525; 44 -1.5,4.025; 45 -1.75,-3.525; 46 -2,4.025; 47 -2.25,-3.525; 48 -2.5,4.025; 49 -2.75,-3.525; 50 -3,4.025; 51 -3.25,-3.525; 52 -3.5,4.025; 53 -3.75,-3.525; 54 -4,4.025; 55 -4.25,-3.525; 56 -4.5,4.025; 57 -4.75,-3.525; 58 -5,4.025; 59 -5.25,-3.525; 60 -5.5,4.025; 61 -5.75,-3.525; 62 -6,4.025; 63 -6.25,-3.525; 64 -6.5,4.025; 65 -6.75,-3.525; 66 -7,4.025; 67 -7.25,-3.525; 68 -7.5,4.025; 69 -7.75,-3.525; 70 -8,4.025; 71 -8.25,-3.525; 72 -8.5,4.025; 73 -8.75,-3.525; 74 -9,4.025; 75 -9.25,-3.525 | smd 1.2 x 2.75: A1 10.35,-2.75; A2 -10.35,-2.75 | hole 1.1: 10,1.75 | hole 1.6: -10,1.75
STAND-OFF-REFLOW-M3.0 = smd 7.4 x 7.4: 1 0,0 | hole 4.4: 0,0
SO08 = smd 0.61 x 2.21: 1 -1.905,-2.616; 2 -0.635,-2.616; 3 0.635,-2.616; 4 1.905,-2.616; 5 1.905,2.616; 6 0.635,2.616; 7 -0.635,2.616; 8 -1.905,2.616
CH376S-SOIC = smd 2.052 x 0.602: A0 -4.654,-0.635; ACT# 4.654,3.175; BZ/D4 4.654,-3.175; D0 4.654,-8.255; D1 4.654,-6.985; D2 4.654,-5.715; GND -4.654,-5.715; INT# -4.654,8.255; NC -4.654,0.635; PCS# 4.654,6.985; RD# -4.654,4.445; RSTI -4.654,6.985; RXD -4.654,1.905; SCK/D5 4.654,-1.905; SCS/D3 4.654,-4.445; SD-CK 4.654,5.715; SD-CS 4.654,1.905; SD-DO 4.654,4.445; SDI/D6 4.654,-0.635; SDO/D7 4.654,0.635; TXD -4.654,3.175; UD+ -4.654,-3.175; UD- -4.654,-4.445; V3 -4.654,-1.905; VCC 4.654,8.255; WR# -4.654,5.715; XI -4.654,-6.985; XO -4.654,-8.255
SOT23-5 = smd 0.69 x 0.99: 1 -0.95,-1.29; 2 0,-1.29; 3 0.95,-1.29; 4 0.95,1.3; 5 -0.95,1.3
SOT223 = smd 1.5 x 2: 1 -2.3,-3.15; 2 0,-3.15; 3 2.3,-3.15 | smd 3.8 x 2: 4 0,3.15
JST_B4B-XH-A(LF)(SN) = drill 1 square: 1 3.75,-0.525 | drill 1: 2 1.25,-0.525; 3 -1.25,-0.525; 4 -3.75,-0.525
JST_B4B-PH-K = drill 0.8 square: 1 3,-0.55 | drill 0.8: 2 1,-0.55; 3 -1,-0.55; 4 -3,-0.55
CUI_UJ2-AV-1-TH = drill 0.9 square: 1 0,0 | drill 0.9: 2 2.5,0; 3 4.5,0; 4 7,0 | drill 2.3: SH1 -3.07,-2.2; SH2 10.07,-2.2
DB2EVC-3.81-4P-GN = drill 1.4 square: 01 -5.715,0 | drill 1.4: 02 -1.905,0; 03 1.905,0; 04 5.715,0
USB-C-16P = smd 0.3 x 1.45: A5 -1.25,0; A6 -0.25,0; A7 0.25,0; A8 1.25,0; B5 1.75,0; B6 0.75,0; B7 -0.75,0; B8 -1.75,0 | smd 0.6 x 1.45: GND -3.225,0; GND2 3.225,0 | smd 1 x 2.1: SHLD1 -4.32,-0.915; SHLD2 4.32,-0.915 | smd 1 x 2.1 bottom: SHLD3 -4.32,-0.915; SHLD4 4.32,-0.915 | smd 1 x 1.6: SHLD5 -4.32,-5.095; SHLD8 4.32,-5.095 | smd 1 x 1.6 bottom: SHLD6 -4.32,-5.095; SHLD7 4.32,-5.095 | smd 0.55 x 1.45: VBUS1 -2.45,0; VBUS2 2.45,0 | hole 0.65: -2.89,-1.445; 2.89,-1.445
CD75 = smd 7 x 2.85: 1 0,2.54; 2 0,-2.54
0603@1 = smd 1.1 x 1: 1 -0.85,0; 2 0.85,0
DISCRETE_R0603 = smd 0.889 x 0.889: 1 -0.762,0; 2 0.762,0
R0603 = smd 0.889 x 0.889: 1 -0.762,0; 2 0.762,0
R0603' = smd 1 x 1.1: 1 -0.85,0; 2 0.85,0
9P-SMD-W/-RING = smd 1.524 x 0.762: 1 0,4.4; 2 0,3.3; 3 0,2.2; 4 0,1.1; 5 0,0; 6 0,-1.1; 7 0,-2.2; 8 0,-3.3; 9 0,-4.4 | smd 1.524 x 1.016: G1 0.6,-5.746 | smd 2.032 x 1.524: G2 10.373,-5.4; G3 10.373,10 | smd 1.524 x 1.524: G4 0.392,9.181 | hole 0.889: 10.9,-2.6; 10.9,5.4
LED_WS2812-2020 = smd 0.7 x 0.7: 1 0.915,-0.55; 2 0.915,0.55; 3 -0.915,0.55; 4 -0.915,-0.55
XCVR_ESP32S3WROOM1N8R8 = smd 1.5 x 0.9: 1 -8.75,5.26; 2 -8.75,3.99; 3 -8.75,2.72; 4 -8.75,1.45; 5 -8.75,0.18; 6 -8.75,-1.09; 7 -8.75,-2.36; 8 -8.75,-3.63; 9 -8.75,-4.9; 10 -8.75,-6.17; 11 -8.75,-7.44; 12 -8.75,-8.71; 13 -8.75,-9.98; 14 -8.75,-11.25; 27 8.75,-11.25; 28 8.75,-9.98; 29 8.75,-8.71; 30 8.75,-7.44; 31 8.75,-6.17; 32 8.75,-4.9; 33 8.75,-3.63; 34 8.75,-2.36; 35 8.75,-1.09; 36 8.75,0.18; 37 8.75,1.45; 38 8.75,2.72; 39 8.75,3.99; 40 8.75,5.26 | smd 0.9 x 1.5: 15 -6.985,-12.5; 16 -5.715,-12.5; 17 -4.445,-12.5; 18 -3.175,-12.5; 19 -1.905,-12.5; 20 -0.635,-12.5; 21 0.635,-12.5; 22 1.905,-12.5; 23 3.175,-12.5; 24 4.445,-12.5; 25 5.715,-12.5; 26 6.985,-12.5 | smd 0.9 x 0.9: 41_1 -1.5,-2.46; 41_2 -2.9,-2.46; 41_3 -0.1,-2.46; 41_4 -2.9,-3.86; 41_5 -1.5,-3.86; 41_6 -0.1,-3.86; 41_7 -2.9,-1.06; 41_8 -1.5,-1.06; 41_9 -0.1,-1.06
CRYSTAL_3.2X2.5 = smd 1.4 x 1.2: 1 -1.1,-0.8; 2 1.1,0.8; GND1 -1.1,0.8; GND2 1.1,-0.8

### Placement (x,y rotation side)
BOOT  30.9,4.7 90 top
C1  4.1,19.4 180 top
C2  10.9,20 270 top
C3  27.2,51.2 0 top
C4  3.6,40.8 0 top
C5  27.6,56.4 0 top
C8  3.8,26.8 0 top
C13  39.8,7.5 270 top
C14  3.8,31.8 180 top
C15  3.8,37.7 180 top
C16  57.8,56.2 90 top
C17  52.38,56.24 0 top
C18  4.1,21.5 0 top
C19  72,56.3 90 top
C20  3.6,34.9 0 top
C22  69.3,56.3 90 top
C28  30.2,20.2 90 top
C29  36.9,20.2 270 top
C30  39.1,42.7 180 top
C31  8.1,5.3 0 top
C32  10uF  [C1206']  39.4,47.8 90 top
C33  28,38.7 270 top
C34  28,26.8 270 top
C35  10uF  [C1206']  33.1,42.7 180 top
C36  41.3,56.2 0 top
D1  21.7,19.7 270 top
D2  27.7,45.8 270 top
D3  SS34  [DO-214AC']  46.8,56 90 top
D13  SS34  [DO-214AC']  3.3,44.5 180 top
EXP1  75,41.5 90 top
EXP2  75,18.5 90 top
H2  44.5,49 0 top
H4  44.5,26 0 top
IC1  34.4,55.9 0 top
IC2  34.8,31.7 0 top
IC3  26.2,20 270 top
IC5  63.6,56.2 270 top
J1  66.8,3.8 0 top
J2  49.6,4.1 180 top
J3  53.3,2.7 180 top
J4  34.5,14.1 0 top
J5  15.3,54.7 180 top
J6  7.8,11.6 270 top
L5  33.9,47.9 270 top
R5  9.8,9.2 90 top
R7  4.2,24.4 180 top
R9  15.3,20 90 top
R16  34,9.4 90 top
R22  27.9,9 90 top
R25  3.8,29.4 180 top
R28  8.4,20 90 top
R33  12.9,20 90 top
R34  17.7,20 90 top
R46  100K  [R0603']  28,33.7 270 top
R61  100K  [R0603']  39.5,20.2 270 top
RESET  36.9,4.7 90 top
SD1  16,16.7 270 top
U1  8.9,1.8 180 top
U3  16.3,36.2 0 top
U$1  [DIAL0]  59.5,0.7 90 top
U$2  [EXPANSION_10]  42.2,30.8 90 top
U$4  [GND_5V_SDA_SCL0]  73.3,1.3 0 bottom
U$6  [EXPANSION_20]  42.2,7.8 90 top
U$7  [GND_D#_D#_5V0]  56.4,1 0 bottom
U$8  [GND_TX_RX_5V0]  41.3,11.6 0 bottom
U$9  [GND_24V_GND_5V0]  23.6,52.5 0 bottom
U$16  [USB0]  1.7,17.5 0 top
U$23  [BOOT0]  27.9,0.5 90 top
U$24  [RESET0]  33.9,0.4 90 top
U$25  [USB0]  40.2,0.4 90 top
U$26  [SD_CARD0]  11,1.3 0 top
U$27  [UART0]  27.1,11 90 top
U$28  [GND_24V_GND_5V0]  23.2,58.8 180 top
XTAL2  33.5,20.2 0 top

### Tracks (layer width: path | path; a pad name or v marks a point on that pad's centre or on a via)
5VREG  (via drill 0.35)
  Top 1.27: C36.+ 43.7,58.5 v44.23,59.02 44.42,58.83 46,58.83 D3.A
  Bottom 1.27: J5.04 9.59,58.05 10.6,59.06 44.19,59.06 v44.23,59.02
  pour Top (no thermals): 34.6,54.4 34.6,44.3 34.9,44 38,44 38.1,44.1 38.2,44.2 38.2,50.8 41.4,54 42.7,54 45,54 45.2,54.2 45.2,56.8 45.4,57 45.5,57.1 47.9,57.1 48.2,57.4 48.2,59.5 48,59.7 45.1,59.7 42.3,59.7 40.8,58.2 40.8,55.2 40.5,54.9 37.5,51.9 36.2,51.9 35.5,51.9 35.3,52.1 35.3,54.4
+3V3  (via drill 0.35)
  Top 0.254: EXP1.10 69.8,48.5 69.5,48.2 69.5,44.2 68.4,43.1 v68.3,43.1 | EXP2.10 68.74,25.5 v68.44,25.2 | 34.7,42.7 34.1,42.7 32.8,41.4 28.3,41.4 28,41.1 C33.1 27.75,39.55 27.1,38.9 27.1,33.4 27.65,32.85 R46.2 28,30.2 28.41,29.8 | IC2.V3 28.41,29.8 | C34.1 28,29.39 28.41,29.8 | D1.4 22.6,18.2 v22.4,18 | R16.2 34.5,10.66 v34.5,16.5 | R22.2 27.04,9.76 25.5,11.3 v25.5,14.2 | R61.2 39.5,18.5 40.6,17.4 v40.7,17.4 | C20.2 4.36,35.96 v5,36.6 4.56,37.04 C15.1 | R25.2 3.04,28.06 3.2,27.9 4.9,27.9 v5,28
  Top 0.406: v14.1,18.4 14.1,20.4 | 14.1,20.4 13.74,20.76 R33.2 11.38,19.24 C2.2 9.92,19.24 R28.2 | 14.1,20.4 14.46,20.76 R9.2 R34.2 | SD1.4 17.1,17.8 16.8,18.1 15.3,18.1
  Top 0.508: 15.3,18.1 14.4,18.1 v14.1,18.4
  Top 0.813: C22.1 68.8,54.15 68.8,53.4 67.43,52.03 67.43,45.47 v67.9,45 | IC2.VCC 37.34,39.95 36.7,40.6 | 36.7,40.6 36.7,42.4 | 36.7,42.4 37,42.7 C30.2 | 36.7,42.4 36.4,42.7 34.7,42.7 C35.1 33.9,43.3 v33.9,45.6 | IC2.PCS# 37.12,38.69 36.7,39.1 36.7,40.6 | v25.8,45.1 25.4,44.7 20.4,44.7 19.19,43.49 11.82,43.49 8.52,40.19 U3.2 6.41,40.19 5.8,40.8 C4.2 5.25,39.25 v5,39 | IC5.4 65.75,55.2 v64.6,55.2
  Top 1.27: IC5.4 68.3,54.65 C22.1 C19.1
  Bottom 0.61: 68.17,27.3 68.17,25.47 v68.44,25.2
  Bottom 0.813: 68.17,27.3 68.17,42.47 68.3,42.6 v68.3,43.1 68.3,44.6 v67.9,45 | v25.8,45.1 26.16,44.74 31.62,44.74 31.91,45.02 33.32,45.02 v33.9,45.6 33.9,53.3 33.49,53.71 33.49,56.11 | v64.6,55.2 64.6,55.52 63.3,56.82 34.2,56.82 33.49,56.11 | 33.49,56.11 32.98,56.62 29.48,56.62 28.23,57.87 12.27,57.87 11.6,57.2 11.6,53.7 10.7,52.8 8.1,52.8 5,49.7 v5,39 v5,36.6 v5,28 5,20.4 7,18.4 v14.1,18.4 16.35,18.4 18.15,16.6 21.5,16.6 22.4,17.5 | v22.4,18 22.4,17.5 | 22.4,17.5 22.4,17.3 v25.5,14.2 28.4,14.2 30.7,16.5 v34.5,16.5 39.8,16.5 v40.7,17.4
+5V  (via drill 0.35)
  Top 0.254: EXP1.8 69.72,49 69.09,48.37 69.09,44.39 68.5,43.8 67.8,43.8 67.2,43.2 v67.2,43.1 | EXP2.8 67.3,26 v67.2,25.9 | v11.4,3.4 10.1,3.4 | U1.4 9.81,3.12 10.1,3.4 | C31.2 8.95,4.25 9.2,4 9.6,4 10.1,3.5 10.1,3.4 | J4.4 30.75,17.65 30.1,18.3 29.6,18.3 27.8,20.1 27.5,20.1 | IC3.2 26.2,20 26.3,20.1 27.5,20.1 | IC3.5 27.5,20.1 | v3.07,25.6 3.36,25.6 C8.2
  Top 0.813: IC5.3 64.95,53.9 66.47,52.38 66.47,44.84 v66.7,44.6 | v67.2,6.9 67.2,5.83 68.05,4.97 J1.2 | v3,42.4 4.1,42.4 5.33,43.62 D13.C
  Top 1.27: IC5.3 58.45,53.9 C16.1 56.11,56.24 C17.+ 54.78,55.38 53.38,53.98 D3.C 46.6,53.77 42.67,53.77 39.5,50.6 39.5,49.3 C32.2
  Bottom 0.813: v66.7,44.6 67.2,44.1 v67.2,43.1 v67.2,25.9 v67.2,6.9 67.2,6.8 65.6,5.2 61.5,5.2 57.6,1.3 47,1.3 46.3,2 | 46.3,2 J3.4 46.3,3.6 46.6,3.9 J2.1 46.6,5.5 44.5,7.6 31.9,7.6 30.75,8.75 J4.4 | 46.3,2 45.69,1.39 12.21,1.39 11.4,2.2 v11.4,3.4 11.4,8.1 9.5,10 5.3,10 3.7,11.6 3.7,14.3 4.13,14.73 4.13,18.4 3.07,19.46 3.07,21.83 2.5,22.4 2.5,23.7 3.07,24.27 v3.07,25.6 3.07,42.33 v3,42.4
+24V  (via drill 0.35)
  Top 0.254: v66.06,26.9 67.7,26.9 68.1,26.5 EXP2.6 | EXP1.6 69.65,49.5 68.69,48.54 68.69,44.56 68.33,44.21 67.51,44.21 67.1,43.8 66.8,43.8 v66.1,43.1
  Top 0.813: v30.4,57.8 30.4,56.8 C5.+ | v66.1,43.1 65.5,43.7 65.5,51.4 v64.6,52.3
  Top 1.27: J5.02 17.2,57.91 18.1,58.8 27.6,58.8 C5.+
  Bottom 0.61: 66.23,27.8 66.23,27.07 v66.06,26.9
  Bottom 0.813: v66.1,43.1 66.23,42.97 66.23,27.8 | v64.6,52.3 65.7,53.4 65.7,55.79 63.7,57.79 v30.41,57.79 v30.4,57.8
  pour Top (no thermals): 31,58.7 31,57.5 31.4,57.1 31.4,55.7 32.7,54.4 32.7,52.3 29.6,52.3 29.3,52 29.3,50.1 29.1,49.9 28,49.9 27.8,50.1 27.8,57.8 28.8,58.8 30.9,58.8
CC1
  Top 0.254: R7.2 3.35,23.85 2.2,22.7 2.2,17.6 1.4,16.8 1.4,14 2.7,12.7 6.1,12.7 6.25,12.85 J6.A5
CC2
  Top 0.254: J6.B5 8.75,9.85 8.95,10.05 R5.2
GND  (via drill 0.35)  (2 unrouted)
  Top 0.254: D1.2 19.1,19.7 v19,19.8 | IC3.3 25,19.05 | 25,19.05 26.05,19.05 v26.2,19.2 | SD1.G4 25.18,17.62 24.9,17.9 24.9,18.95 25,19.05 | J6.GND2 9.78,8.38 R5.1 10.6,7.55 SD1.G2 10.43,6.5 8.1,6.5 7.25,5.65 C31.1
  Top 1.27: C17.- 51.59,57.85 C16.2 58.45,58.5 IC5.1 61.01,59.06 68.19,59.06 C22.2 C19.2
  other vias: 2,49 10.5,38.9 11.6,35 7.9,23.4 1.8,11.2 7.4,43 63.1,51.1 50.1,48.2 68.8,21.8 68.8,9.4 46,14.1 44,9.9 34.5,25 36.4,28.7 15.1,15.4 12.9,15 13.1,13.2 4.9,7.2 2.4,14.4 1.1,12.6 1,18.6 16.6,22.1 12,22.1 66.7,59.2 62.4,55.2 10.8,14.6 8.8,7.3 6.4,1 0.9,6.5 73.3,1 79,6.6 73.1,12.5 79,53.4 74,53.4 73.8,59.1 69.3,56.4 37.4,54.7 52.4,55.7 39.2,54.8 28.6,45.8 26.9,45.8 46.5,31.5 61.8,47.7 55.7,53.8 75.3,51 69.3,51.2 48.4,28.3 47.2,20.5 51.9,8.7 59.8,9.2 23.8,13.2 24.5,3.9 14.4,3.8 30.9,4.7 36.1,3.7 74.3,27.1 73.1,33.9 76,35.9 76.6,41.3 24.7,53.6 6.2,59.1 5.9,52.9
  pour Top (rank 6, no thermals): 0,60 80,60 80,0 0,0
  pour Bottom (no thermals): 0,60 80,60 80,0 0,0
IO0/BOOTMODE  (via drill 0.35)
  Top 0.254: R22.1 29.26,8.24 | BOOT.2 29.65,7.85 29.26,8.24 | U3.27 25,24.9 v25,23.6 | 29.26,8.24 29.3,8.28 29.3,9.6 29,9.9 29,16.3 v28.8,16.5
  Bottom 0.254: v28.8,16.5 28.8,17.9 28.9,18 28.9,23 28.3,23.6 v25,23.6
IO3/TWI_SDA  (via drill 0.35)
  Top 0.254: EXP2.14 74,24.5 74.5,25 v75.6,25 | EXP1.14 75.8,47.5 v76.2,47.1 | v11.2,28.5 11.2,27.8 9.31,25.91 U3.15
  Bottom 0.254: J1.3 68.08,5.8 69.6,5.8 71.9,8.1 71.9,9.3 74.64,12.04 74.64,21.94 76.15,23.45 76.15,24.45 v75.6,25 75.6,33.58 72.88,36.29 72.88,41.83 75.71,44.66 75.71,45.51 76.3,46.1 76.3,47 v76.2,47.1 76.2,47.34 75.97,47.57 66.07,47.57 63.09,44.59 49.96,44.59 48.74,43.37 36.49,43.37 35.43,42.31 33.03,42.31 32.74,42.02 20.27,42.02 15.85,37.6 14.4,37.6 14,37.2 14,36.1 14.57,35.53 14.57,30.74 13.79,29.97 13.79,28.9 12.8,27.91 11.79,27.91 v11.2,28.5
IO4/TWI_SCK  (via drill 0.35)
  Top 0.254: EXP2.16 74.7,24 v74.9,24.2 | EXP1.16 74.9,47 v75.3,46.6 | v14.8,36.6 13.75,37.65 U3.4
  Bottom 0.254: J1.4 64.28,4.5 66.2,4.5 67.91,6.21 69.43,6.21 71.49,8.27 71.49,9.47 74.23,12.21 74.23,22.11 74.9,22.77 v74.9,24.2 74.9,25.3 75.1,25.5 75.1,33.5 72.47,36.12 72.47,42 75.3,44.83 v75.3,46.6 74.74,47.16 66.24,47.16 63.26,44.18 50.13,44.18 48.91,42.96 36.66,42.96 35.6,41.9 33.2,41.9 32.91,41.61 20.44,41.61 15.43,36.6 v14.8,36.6
IO5/SDCS  (via drill 0.35)
  Top 0.254: R25.1 5.08,29.4 5.91,30.23 5.91,35.8 6.49,36.38 U3.5 7.57,36.4 v9,36.4 | SD1.2 v19.3,18.2 | v19.8,20.7 20.05,20.45 D1.1
  Bottom 0.254: v19.3,18.2 19.8,18.7 v19.8,20.7 19.8,23.59 19.4,23.99 11.23,23.99 10.82,24.4 10.1,24.4 8.3,26.2 8.3,35.7 v9,36.4
IO17_UART1_TXD  (via drill 0.35)
  Top 0.254: EXP1.23 78.65,45.25 79.22,44.68 v79.22,43.7 | EXP2.23 79.1,21.68 v79.1,21.3 | v11.1,30.1 10.9,30.3 9.8,30.3 9.5,30 7.58,30 U3.10 | v41.4,45.7 42,45.7 42.8,44.9 46.6,44.9 v47.8,46.1
  Bottom 0.254: v79.1,21.3 79.57,21.77 79.57,42.35 79.22,42.7 v79.22,43.7 79.57,44.05 79.57,48.63 78.6,49.6 65.23,49.6 62.25,46.62 48.32,46.62 v47.8,46.1 | v11.1,30.1 11.49,29.71 12.38,29.71 13.66,30.98 13.66,35.29 13.19,35.76 13.19,37.54 14.06,38.41 15.52,38.41 19.19,42.09 19.19,43.37 20.63,44.81 22.97,44.81 23.72,44.05 31.9,44.05 32.19,44.34 34.59,44.34 35.65,45.4 41.1,45.4 v41.4,45.7
IO18_UART1_RXD  (via drill 0.35)
  Top 0.254: EXP2.21 77.55,22.75 77.4,22.6 77.4,22 78.2,21.2 v78.2,20.7 | v78.3,44.4 77.9,44.4 77.3,45 77.3,45.6 77.45,45.75 EXP1.21 | U3.11 8.96,28.76 9.5,29.3 v10.2,29.3
  Bottom 0.254: v78.2,20.7 78.34,20.84 78.34,21.57 79.16,22.39 79.16,42.12 78.55,42.74 78.55,44.15 v78.3,44.4 79.16,45.26 79.16,48.46 78.43,49.19 65.4,49.19 62.42,46.22 49.29,46.22 48.07,44.99 35.82,44.99 34.76,43.93 32.36,43.93 32.07,43.65 23.55,43.65 22.8,44.4 20.8,44.4 19.6,43.2 19.6,41.92 15.68,38.01 14.23,38.01 13.59,37.37 13.59,35.93 14.06,35.46 14.06,30.81 12.55,29.3 v10.2,29.3
IO35/MOSI  (via drill 0.35)
  Top 0.254: EXP2.18 73.8,23.5 v74,23.3 | v33.7,41.1 33.8,41 33.8,35.2 37.94,31.07 IC2.SDI/D6 | EXP1.18 74,46.5 v74.4,46.1 | v14.2,28.3 14.9,27.6 16.73,27.6 18.03,26.29 24.98,26.29 U3.28 26.07,26.22 26.29,26 26.29,22.64 26.16,22.51 22.51,22.51 21.5,21.5 21.5,19.2 21.25,18.95 D1.3 18.95,18.95 18.2,18.2 18.2,18.1 | 18.2,18.1 SD1.3 | R9.1 15.94,18.6 17.02,18.6 17.2,18.41 17.89,18.41 18.2,18.1
  Bottom 0.254: v74,23.3 74,26.1 72.07,28.03 72.07,42.17 74.4,44.5 v74.4,46.1 73.75,46.76 66.41,46.76 63.43,43.78 50.3,43.78 49.08,42.55 36.84,42.55 35.48,41.2 33.8,41.2 v33.7,41.1 33.08,41.1 32.97,41.21 20.61,41.21 14.97,35.57 14.97,30.57 14.2,29.8 v14.2,28.3
IO36/SCLK  (via drill 0.35)
  Top 0.254: EXP2.22 71.7,22.5 v72.4,21.8 | v32.76,39.86 33.39,39.23 33.39,35.03 37.8,30.62 37.8,30.2 38.2,29.8 IC2.SCK/D5 | EXP1.22 72.2,45.5 v72.6,45.1 | v15.3,28.4 15.69,28.01 16.89,28.01 18.2,26.7 23.1,26.7 23.89,27.49 U3.29 26.2,27.49 26.69,27 26.69,22.47 26.33,22.11 22.68,22.11 21.91,21.33 21.91,19.89 22.1,19.7 | 22.1,19.7 D1.5 | SD1.5 16,15.5 16.3,15.2 18.8,15.2 19,15.4 21.3,15.4 21.6,15.7 21.6,18.73 21.91,19.03 21.91,19.51 22.1,19.7
  Bottom 0.254: v72.4,21.8 72.4,22.47 72.34,22.53 72.34,26.61 71.26,27.69 71.26,42.51 72.6,43.85 v72.6,45.1 71.76,45.94 66.74,45.94 63.76,42.96 50.64,42.96 49.41,41.74 37.17,41.74 35.07,39.64 32.98,39.64 v32.76,39.86 32.23,40.39 20.94,40.39 15.79,35.24 15.79,28.89 v15.3,28.4
IO37/MISO  (via drill 0.35)
  Top 0.254: EXP2.20 72.8,23 v73,22.8 | IC2.SDO/D7 37.24,32.34 34.21,35.37 34.21,39.81 v34.8,40.4 | EXP1.20 73.1,46 v73.5,45.6 | v15,29.5 15.7,29.5 16.79,28.41 17.06,28.41 18.37,27.11 22.91,27.11 24.56,28.76 U3.30 26.54,28.76 27.1,28.2 27.1,22.3 26.5,21.7 22.9,21.7 22.6,21.4 D1.6 22.85,20.45 23.3,20 23.3,17.8 22.01,16.51 22.01,15.53 21.47,14.99 19.17,14.99 18.67,14.49 14.71,14.49 13.8,15.4 SD1.7
  Top 0.406: SD1.7 13.8,17.5 12.9,18.4 R33.1
  Bottom 0.254: v73,22.8 73,26.52 71.66,27.86 71.66,42.34 73.5,44.17 v73.5,45.6 72.75,46.35 66.57,46.35 63.6,43.37 50.47,43.37 49.25,42.15 37,42.15 35.26,40.4 v34.8,40.4 33.2,40.4 32.8,40.8 20.78,40.8 15.38,35.41 15.38,29.88 v15,29.5
IO43_UART0_TXD  (via drill 0.35)
  Top 0.254: EXP2.19 77.45,23.25 76.97,22.77 76.97,21.19 v77.16,21 77.4,20.76 77.4,9.8 76.7,9.1 76.1,9.1 75.9,8.9 75.9,7.9 74.9,6.9 71.9,6.9 71.1,7.7 65.5,7.7 65.2,8 v64.6,8 | v77.5,43.6 76.89,44.21 76.89,45.79 77.35,46.25 EXP1.19 | U3.37 23.15,37.65 22.5,38.3 v22.5,43.6
  Bottom 0.254: v77.16,21 78.76,22.6 78.76,41.96 77.5,43.21 v77.5,43.6 77.5,45 77.8,45.3 78.2,45.3 78.76,45.86 78.76,48.29 78.26,48.79 65.56,48.79 62.59,45.81 49.46,45.81 48.24,44.59 35.99,44.59 34.93,43.53 32.53,43.53 32.24,43.24 22.86,43.24 v22.5,43.6 | J4.2 35.75,11.24 38.3,8.69 44.95,8.69 47.14,6.51 53.83,6.51 55.03,7.71 64.31,7.71 v64.6,8
IO44_UART0_RXD  (via drill 0.35)
  Top 0.254: EXP2.17 77.35,23.75 76.5,22.9 76.5,19.95 v76.65,19.8 76.99,19.46 76.99,9.97 76.53,9.51 75.93,9.51 75.49,9.07 75.49,8.07 74.73,7.31 72.07,7.31 71.27,8.11 66.29,8.11 v65.9,8.5 | EXP1.17 77.25,46.75 76.49,45.99 76.49,43.39 v76.3,43.2 | U3.36 23.84,36.38 21.79,38.43 21.79,42.91 v21.5,43.2
  Bottom 0.254: v76.65,19.8 76.4,20.05 76.4,21.4 76.8,21.8 77.38,21.8 78.35,22.77 78.35,41.59 76.74,43.2 v76.3,43.2 76.3,43.7 77.09,44.49 77.09,45.17 77.63,45.71 78.03,45.71 78.35,46.02 78.35,48.1 78.07,48.38 65.73,48.38 62.75,45.4 49.63,45.4 48.41,44.18 36.16,44.18 35.09,43.12 32.7,43.12 32.41,42.83 21.87,42.83 v21.5,43.2 | J4.3 33.25,9.54 34.5,8.29 44.78,8.29 46.97,6.1 54,6.1 55.2,7.3 65.2,7.3 65.9,8 v65.9,8.5
IO48/STATUSLED  (via drill 0.35)
  Top 0.254: U3.25 22.02,22.59 21.23,21.8 v20.8,21.8 | IC3.1 23.65,20.95 v23.6,20.9
  Bottom 0.254: v20.8,21.8 22.7,21.8 v23.6,20.9
LEDOUT  (via drill 0.35)
  Top 0.254: EXP1.72 69.9,33 69.6,32.7 69.6,32.2 71.9,29.9 75.2,29.9 75.8,29.3 75.8,28.03 76.43,27.4 v77,27.4 | v7.3,3.7 7.99,3.02 U1.1
  Bottom 0.254: v77,27.4 77,27.04 77.54,26.5 77.54,23.1 77.05,22.61 76.46,22.61 75.45,21.6 75.45,8.05 72.83,5.43 72.83,2.35 71.67,1.19 62.42,1.19 61.83,0.6 8,0.6 7.3,1.3 v7.3,3.7
LEDOUT2  (via drill 0.35)
  Top 0.254: v76.2,10.5 75.7,10 EXP2.72 | EXP1.74 72.3,32.5 72.6,32.8 76.7,32.8 v77,32.5
  Bottom 0.254: v76.2,10.5 75.86,10.84 75.86,21.43 76.63,22.21 77.22,22.21 77.94,22.93 77.94,32.06 77.5,32.5 v77,32.5
N$1  (via drill 3.2 pad 6)
  other vias: 3.5,56.5
N$2
  Top 0.254: U1.3 11.45,1.25 12.3,2.1 12.3,4.8 12.2,4.9 12.2,13.7 12.59,14.09 18.84,14.09 19.34,14.59 21.64,14.59 22.05,15 26.4,15 27.5,16.1 IC3.4
N$3  (via drill 3.2 pad 6)
  other vias: 76.5,3.5
N$4
  pour Top: 52.44,26.01 49.63,25.97 52.11,26.76 52.58,27.12 53.2,27.44 56.19,24.42 58.13,22.47 54.03,22.47 53.88,25.36 52.58,25.87
N$5
  pour Top (rank 2): 58.53,19.99 56.43,22.47 56.89,19.06 57.12,17.31
N$6
  pour Top: 60.93,22.47 57.95,26.1 64.35,26.1
N$7  (via drill 3.2 pad 6)
  other vias: 76.5,56.5
N$8  (via drill 3.2 pad 6)
  other vias: 3.5,3.5
N$19
  Top 0.254: C13.2 40.45,6.65 41.6,5.5 41.8,5.3 42.2,4.9 J3.SH2 43.23,1.88 44,1.11 55.91,1.11 56.5,1.7 56.5,4.77 J3.SH1
N$31
  Top 0.254: XTAL2.1 32.35,19.35 C28.1 30.15,19.3 29.2,19.3 28.5,20 28.5,24.4 28.82,24.71 IC2.XI
N$32
  Top 0.254: C29.1 36.85,21 XTAL2.2 34.6,22.4 33.55,23.45 IC2.XO
N$37
  pour Top (rank 2, no thermals): 33.3,54.4 33.3,51.9 32.8,51.4 30,51.4 29.9,51.3 29.9,49.4 28.9,48.4 26.6,48.4 26.6,47.2 26.7,47.1 27.2,46.6 29.1,46.6 29.9,45.8 29.9,44.3 32.7,44.3 32.8,44.4 32.8,49.3 34,50.5 34.2,50.7 34.2,54.4
N$38
  Top 0.254: R46.1 28.32,34.88 IC2.TXD
N$47  (via drill 0.35)
  Top 0.508: R34.1 16.66,19.24 v16.5,19.4 | v20.7,18.1 20.4,17.8 SD1.1
  Bottom 0.508: v20.7,18.1 20.31,18.1 19.62,17.41 18.48,17.41 v16.5,19.4
N$48
  Top 0.406: SD1.8 12.7,17.8 12.3,18.2 9.44,18.2 R28.1
RESET  (via drill 0.35)
  Top 0.254: EXP2.12 73.8,25 74.6,25.8 v76.5,25.8 | v61.4,1.6 60.5,0.7 39.6,0.7 38.2,2.1 38.2,3.9 36.9,5.2 RESET.2 35.85,7.85 35.06,8.64 R16.1 | EXP1.12 76.7,48 v77.1,47.6 | v20.4,42.8 12.1,42.8 9.2,39.9 9.2,39.1 9,38.9 7.57,38.9 U3.3 6.95,38.92 6.45,38.42 6.45,36.95 5.5,36 5.5,34 4.56,33.06 C14.1
  Bottom 0.254: v61.4,1.6 71.5,1.6 72.4,2.5 72.4,5.58 75.05,8.22 75.05,21.77 77.13,23.86 77.13,25.2 76.53,25.8 v76.5,25.8 76.5,26 76.01,26.49 76.01,33.74 73.29,36.46 73.29,41.66 76.11,44.49 76.11,45.34 77.1,46.33 v77.1,47.6 77.1,47.65 76.77,47.97 65.9,47.97 62.92,45 49.8,45 48.57,43.77 36.33,43.77 35.26,42.71 32.86,42.71 32.58,42.43 21.2,42.43 20.83,42.8 v20.4,42.8
RESET_IN
  Top 0.254: C33.2 28.84,38.69 IC2.RSTI
SHLD
  Top 0.406: C1.1 4.95,17.45 6.48,15.92 J6.SHLD3
SPARE0  (via drill 0.35)
  Top 0.254: EXP1.36 65.4,42 v65,42.4 | EXP2.36 65.4,19 v65,19.4 | v9.2,27.5 v9.19,27.49 U3.12
  Bottom 0.254: v65,19.4 v65,42.4 64.53,42.4 64.37,42.56 50.8,42.56 49.58,41.34 37.34,41.34 35.21,39.2 31.9,39.2 31.11,39.99 21.11,39.99 16.19,35.07 16.19,28.11 15.58,27.5 v9.2,27.5
SPARE1  (via drill 0.35)
  Top 0.254: EXP1.38 64.5,41.5 v64.1,41.9 | EXP2.38 64.5,18.5 v64.1,18.9 | v11.9,25.2 11.86,25.16 U3.17
  Bottom 0.254: v64.1,18.9 v64.1,41.9 63.63,41.9 63.38,42.15 50.97,42.15 49.75,40.93 37.51,40.93 35.38,38.8 32.2,38.8 32.03,38.8 31.73,38.8 30.94,39.58 21.28,39.58 16.6,34.9 16.6,27.92 15.69,27.01 13.21,27.01 11.9,25.7 v11.9,25.2
SPARE2  (via drill 0.35)
  Top 0.254: EXP1.40 63.6,41 v63.2,41.4 | EXP2.40 63.6,18 v63.2,18.4 | v13.1,25.2 13.12,25.18 U3.18
  Bottom 0.254: v63.2,18.4 v63.2,41.4 62.85,41.74 51.14,41.74 49.92,40.52 37.68,40.52 35.55,38.39 31.56,38.39 30.78,39.17 21.45,39.17 17.01,34.73 17.01,27.76 15.76,26.51 13.91,26.51 13.1,25.7 v13.1,25.2
SPARE3  (via drill 0.35)
  Top 0.254: EXP1.42 62.7,40.5 v62.3,40.9 | EXP2.42 62.7,17.5 v62.3,17.9 | v14.4,25.2 U3.19
  Bottom 0.254: v62.3,17.9 v62.3,40.9 61.86,41.34 51.31,41.34 50.09,40.12 37.85,40.12 35.71,37.98 31.39,37.98 30.61,38.77 21.62,38.77 17.41,34.56 17.41,27.59 15.93,26.1 14.9,26.1 14.4,25.6 v14.4,25.2
SPARE4  (via drill 0.35)
  Top 0.254: EXP1.44 61.8,40 v61.4,40.4 | EXP2.44 61.8,17 v61.4,17.4 | v15.7,25.2 15.66,25.16 U3.20
  Bottom 0.254: v61.4,17.4 v61.4,40.4 60.87,40.93 51.48,40.93 50.26,39.71 38.01,39.71 35.88,37.58 31.22,37.58 30.44,38.36 21.79,38.36 17.82,34.4 17.82,27.42 15.7,25.3 v15.7,25.2
SPARE5  (via drill 0.35)
  Top 0.254: EXP1.46 60.9,39.5 v60.5,39.9 | EXP2.46 60.9,16.5 v60.5,16.9 | v16.9,25.2 16.9,23.73 U3.21
  Bottom 0.254: v60.5,16.9 v60.5,39.9 59.87,40.53 51.65,40.53 50.42,39.3 38.18,39.3 36.05,37.17 31.05,37.17 30.27,37.95 21.95,37.95 18.23,34.23 18.23,27.23 16.9,25.9 v16.9,25.2
SPARE6  (via drill 0.35)
  Top 0.254: EXP1.48 60,39 v59.6,39.4 | EXP2.48 60,16 v59.6,16.4 | v18.2,25.2 U3.22
  Bottom 0.254: v59.6,16.4 v59.6,39.4 58.88,40.12 51.81,40.12 50.59,38.9 38.35,38.9 36.22,36.77 30.89,36.77 30.1,37.55 22.12,37.55 18.63,34.06 18.63,27.06 18.2,26.62 v18.2,25.2
SPARE7  (via drill 0.35)
  Top 0.254: EXP1.50 59.1,38.5 v58.7,38.9 | EXP2.50 59.1,15.5 v58.7,15.9 | U3.8 10.23,32.57 12.2,30.6 19.3,30.6 v19.5,30.8
  Bottom 0.254: v58.7,15.9 v58.7,38.9 57.89,39.71 51.98,39.71 50.76,38.49 38.52,38.49 36.39,36.36 30.72,36.36 29.93,37.14 22.29,37.14 19.04,33.89 19.04,31.26 v19.5,30.8
SPARE8  (via drill 0.35)
  Top 0.254: EXP1.52 58.2,38 v57.8,38.4 | EXP2.52 58.2,15 v57.8,15.4 | U3.9 10.93,31.3 12.03,30.19 18.91,30.19 v19.4,29.7
  Bottom 0.254: v57.8,15.4 v57.8,38.4 56.99,39.21 52.05,39.21 50.93,38.09 38.69,38.09 36.56,35.95 30.55,35.95 29.77,36.74 22.46,36.74 19.64,33.92 19.64,32.35 20.2,31.8 20.2,30.1 19.8,29.7 v19.4,29.7
SPARE9  (via drill 0.35)
  Top 0.254: EXP1.54 57.3,37.5 v56.9,37.9 | EXP2.54 57.3,14.5 v56.9,14.9 | v19.5,25.2 19.5,23.73 U3.23
  Bottom 0.254: v56.9,14.9 v56.9,37.9 56.2,38.6 52.02,38.6 51.1,37.68 38.86,37.68 36.72,35.55 30.38,35.55 29.6,36.33 22.63,36.33 20.05,33.75 20.05,32.52 20.61,31.97 20.61,29.81 19.04,28.24 19.04,26.96 19.5,26.5 v19.5,25.2
SPARE10  (via drill 0.35)
  Top 0.254: EXP1.56 56.4,37 v56,37.4 | EXP2.56 56.4,14 v56,14.4 | U3.31 24.23,30.03 23.9,29.7 23.9,28.68 22.73,27.51 20.29,27.51 v19.9,27.9
  Bottom 0.254: v56,14.4 v56,37.4 55.31,38.09 52.09,38.09 51.27,37.27 39.02,37.27 36.89,35.14 30.21,35.14 29.43,35.92 22.8,35.92 20.46,33.59 20.46,32.69 21.01,32.14 21.01,29.64 19.9,28.52 v19.9,27.9
SPARE11  (via drill 0.35)
  Top 0.254: EXP1.58 55.5,36.5 v55.1,36.9 | EXP2.58 55.5,13.5 v55.1,13.9 | v21.2,33.1 20.9,32.8 20.9,31.9 21.5,31.3 U3.32
  Bottom 0.254: v55.1,13.9 v55.1,36.9 54.51,37.49 52.06,37.49 51.44,36.87 39.19,36.87 37.06,34.73 30.04,34.73 29.26,35.52 22.96,35.52 21.2,33.75 v21.2,33.1
SPARE12  (via drill 0.35)
  Top 0.254: EXP1.60 54.6,36 v54.2,36.4 | EXP2.60 54.6,13 v54.2,13.4 | U3.33 25.02,32.6 24,32.6 23.2,31.8 22.4,31.8 22.1,32.1 v21.8,32.1
  Bottom 0.254: v54.2,13.4 v54.2,36.4 53.72,36.88 52.02,36.88 51.6,36.46 39.36,36.46 37.23,34.33 29.88,34.33 29.09,35.11 23.13,35.11 21.86,33.84 21.86,32.16 v21.8,32.1
SPARE13  (via drill 0.35)
  Top 0.254: EXP1.62 53.7,35.5 v53.3,35.9 | EXP2.62 53.7,12.5 v53.3,12.9 | v22.7,32.7 23.43,32.7 24.57,33.84 U3.34
  Bottom 0.254: v53.3,12.9 v53.3,35.9 52.91,36.29 52.01,36.29 51.77,36.05 39.53,36.05 37.4,33.92 29.71,33.92 28.92,34.7 23.3,34.7 22.26,33.67 22.26,33.14 v22.7,32.7
SPARE14  (via drill 0.35)
  Top 0.254: EXP1.64 52.8,35 v52.4,35.4 | EXP2.64 52.8,12 v52.4,12.4 | v23.4,33.8 23.4,34.3 24.21,35.11 U3.35
  Bottom 0.254: v52.4,12.4 v52.4,35.4 52.15,35.65 39.7,35.65 37.57,33.52 29.54,33.52 28.76,34.3 23.9,34.3 v23.4,33.8
SPARE15  (via drill 0.35)
  Top 0.254: EXP1.66 51.8,34.5 v51.5,34.8 | EXP2.66 51.9,11.5 v51.5,11.9 | v23.3,25.1 23.29,25.09 U3.26
  Bottom 0.254: v51.5,11.9 v51.5,34.8 51.06,35.24 39.87,35.24 37.73,33.11 25.86,33.11 25.18,32.42 24.02,32.42 23.4,31.8 22.7,31.8 21.42,30.52 21.42,29.47 20.6,28.65 20.6,25 21.3,24.3 22.9,24.3 23.3,24.7 v23.3,25.1
SPARE16  (via drill 0.35)
  Top 0.254: EXP1.68 51,34 v50.7,33.7 | EXP2.68 51,11 v50.6,11.4 | U3.16 10.59,25.18 v10.6,25.2
  Bottom 0.254: v50.6,11.4 50.6,33.6 v50.7,33.7 49.57,34.83 40.03,34.83 37.9,32.7 26.03,32.7 25.34,32.02 24.19,32.02 23.57,31.39 22.87,31.39 21.83,30.35 21.83,29.3 21.01,28.48 21.01,25.19 21.49,24.71 22.23,24.71 22.5,24.98 22.5,25.7 22.7,25.9 23.8,25.9 24.1,25.6 24.1,24.5 23.49,23.89 21.13,23.89 20.62,24.4 11.4,24.4 v10.6,25.2
SPARE17  (via drill 0.35)
  Top 0.254: EXP1.70 51.7,33.5 51.1,32.9 v49.7,32.9 | EXP2.70 50.1,10.5 v49.7,10.9 | U3.24 20.75,24.84 21.4,25.5 v21.8,25.5
  Bottom 0.254: v49.7,10.9 v49.7,32.9 49.7,33.3 48.57,34.43 40.2,34.43 38.07,32.29 26.19,32.29 25.51,31.61 24.36,31.61 23.74,30.99 23.04,30.99 22.23,30.18 22.23,29.13 21.41,28.31 21.41,25.89 v21.8,25.5
UD+
  Top 0.254: IC2.UD+ 34.67,28.52 37.19,26.01 37.19,23.23 38.5,21.93 38.5,18.4 48.21,8.69 48.21,6.76 50.32,4.65 J2.3 50.8,4.45 J3.2
UD-
  Top 0.254: IC2.UD- 35.37,27.25 36.79,25.84 36.79,23.06 38.09,21.76 38.09,18.23 47.8,8.53 47.8,6.5 48.6,5.7 J2.2 48.8,4.45 J3.3
USB_D_N
  Top 0.254: J6.A7 6.85,11.35 6.6,11.6 6.6,12.2 6.75,12.35 J6.B7 8.95,12.35 9.2,12.6 9.2,14.9 8.4,15.7 8.4,16.4 7.6,17.2 7.5,17.2 6.2,18.5 6.2,25.8 6.62,26.22 U3.13
USB_D_P
  Top 0.254: J6.A6 8.65,11.85 8.9,11.6 | 8.9,11.6 9.1,11.4 9.1,11.1 8.85,10.85 J6.B6 | U3.14 7.05,24.95 6.61,24.51 6.61,18.67 7.67,17.61 7.77,17.61 8.81,16.57 8.81,15.87 9.61,15.07 9.61,12.31 8.9,11.6
USB_INT  (via drill 0.35)
  Top 0.254: IC2.INT# 31.25,39.95 32.99,38.21 32.99,30.41 v33.5,29.9 | U3.7 9.54,33.84 12.37,31.01 18.51,31.01 19.12,31.62 20.03,31.62 21.95,29.7 22.4,29.7 v23.1,29
  Bottom 0.254: v33.5,29.9 32.73,30.67 28.64,30.67 27.17,29.19 23.69,29.19 23.5,29 v23.1,29
USBMS_CS  (via drill 0.35)
  Top 0.254: IC2.SCS/D3 38.24,27.25 | v34.7,30.6 36.83,30.6 37.9,29.52 37.9,27.6 38.24,27.25 | 38.24,27.25 37.6,26.61 37.6,23.4 39.5,21.5 R61.1 | U3.6 8.84,35.11 12.54,31.41 18.34,31.41 18.95,32.03 20.2,32.03 22.02,30.2 23.1,30.2 v23.2,30.1
  Bottom 0.254: v34.7,30.6 34.2,30.6 33.73,31.07 28.47,31.07 27,29.6 23.7,29.6 v23.2,30.1
VBUS  (via drill 0.35)
  Top 0.406: J6.VBUS1 7.02,14.05 6.57,13.6 v4.8,13.6 | J6.VBUS2 7.02,9.15 5.6,10.57 v5.6,11.6 | C18.1 3.25,22.55 v3.8,23.1
  Top 0.813: D13.A 1.1,44.67 v1.1,46.6
  Bottom 0.813: v1.1,46.6 4.04,43.66 4.04,23.34 v3.8,23.1 4.04,22.86 4.04,19.86 5.1,18.8 5.1,13.9 v4.8,13.6 4.8,12.4 v5.6,11.6
ZUTEX_EXP1_CS  (via drill 0.35)
  Top 0.254: EXP1.32 70.97,43.83 v70.6,44.2 | v70.7,21.2 69.9,21.2 69.7,21 69.7,19.7 69.9,19.5 EXP2.34 | v69.4,30.4 69.4,30.8 67.7,32.5 52.1,32.5 51.1,31.5 48.42,31.5 47.3,32.62 v47.3,32.9 | U3.39 25.38,40.19 26.69,38.87 26.69,33.23 27.1,32.83 27.1,32.1 27.4,31.8 27.4,31.1 v26.6,30.3
  Bottom 0.254: v70.6,44.2 70.6,43 70.44,42.84 70.44,31.44 v69.4,30.4 69.4,29.5 70.44,28.46 70.44,27.36 71.53,26.27 71.53,22.5 71.19,22.17 71.19,21.69 v70.7,21.2 | v47.3,32.9 46.59,33.61 40.54,33.61 38.41,31.48 27.78,31.48 v26.6,30.3
ZUTEX_EXP2_CS  (via drill 0.35)
  Top 0.254: EXP1.34 72.1,42.5 72.3,42.7 72.3,43.8 v71.8,44.3 | v72.4,20.6 72.4,20.2 72.2,20 EXP2.32 | v70.5,29.9 70.5,30.52 68.03,33 51.9,33 50.9,32 49,32 48.5,32.5 v48.5,32.9 | U3.38 26.07,38.92 26.29,38.7 26.29,33.06 26.62,32.73 26.62,31.52 v26.6,31.5
  Bottom 0.254: v71.8,44.3 71.8,43.62 70.85,42.67 70.85,30.25 v70.5,29.9 70.85,29.55 70.85,27.53 71.94,26.44 71.94,22.34 71.6,22 71.6,21.4 v72.4,20.6 | v48.5,32.9 48.5,33.2 47.68,34.02 40.37,34.02 38.24,31.89 27.59,31.89 27.2,31.5 v26.6,31.5

### Text on the board
tPlace: E-KEY | E-KEY